# Altium project CGRA_Board_2.PrjPcb (part 1 of 3)
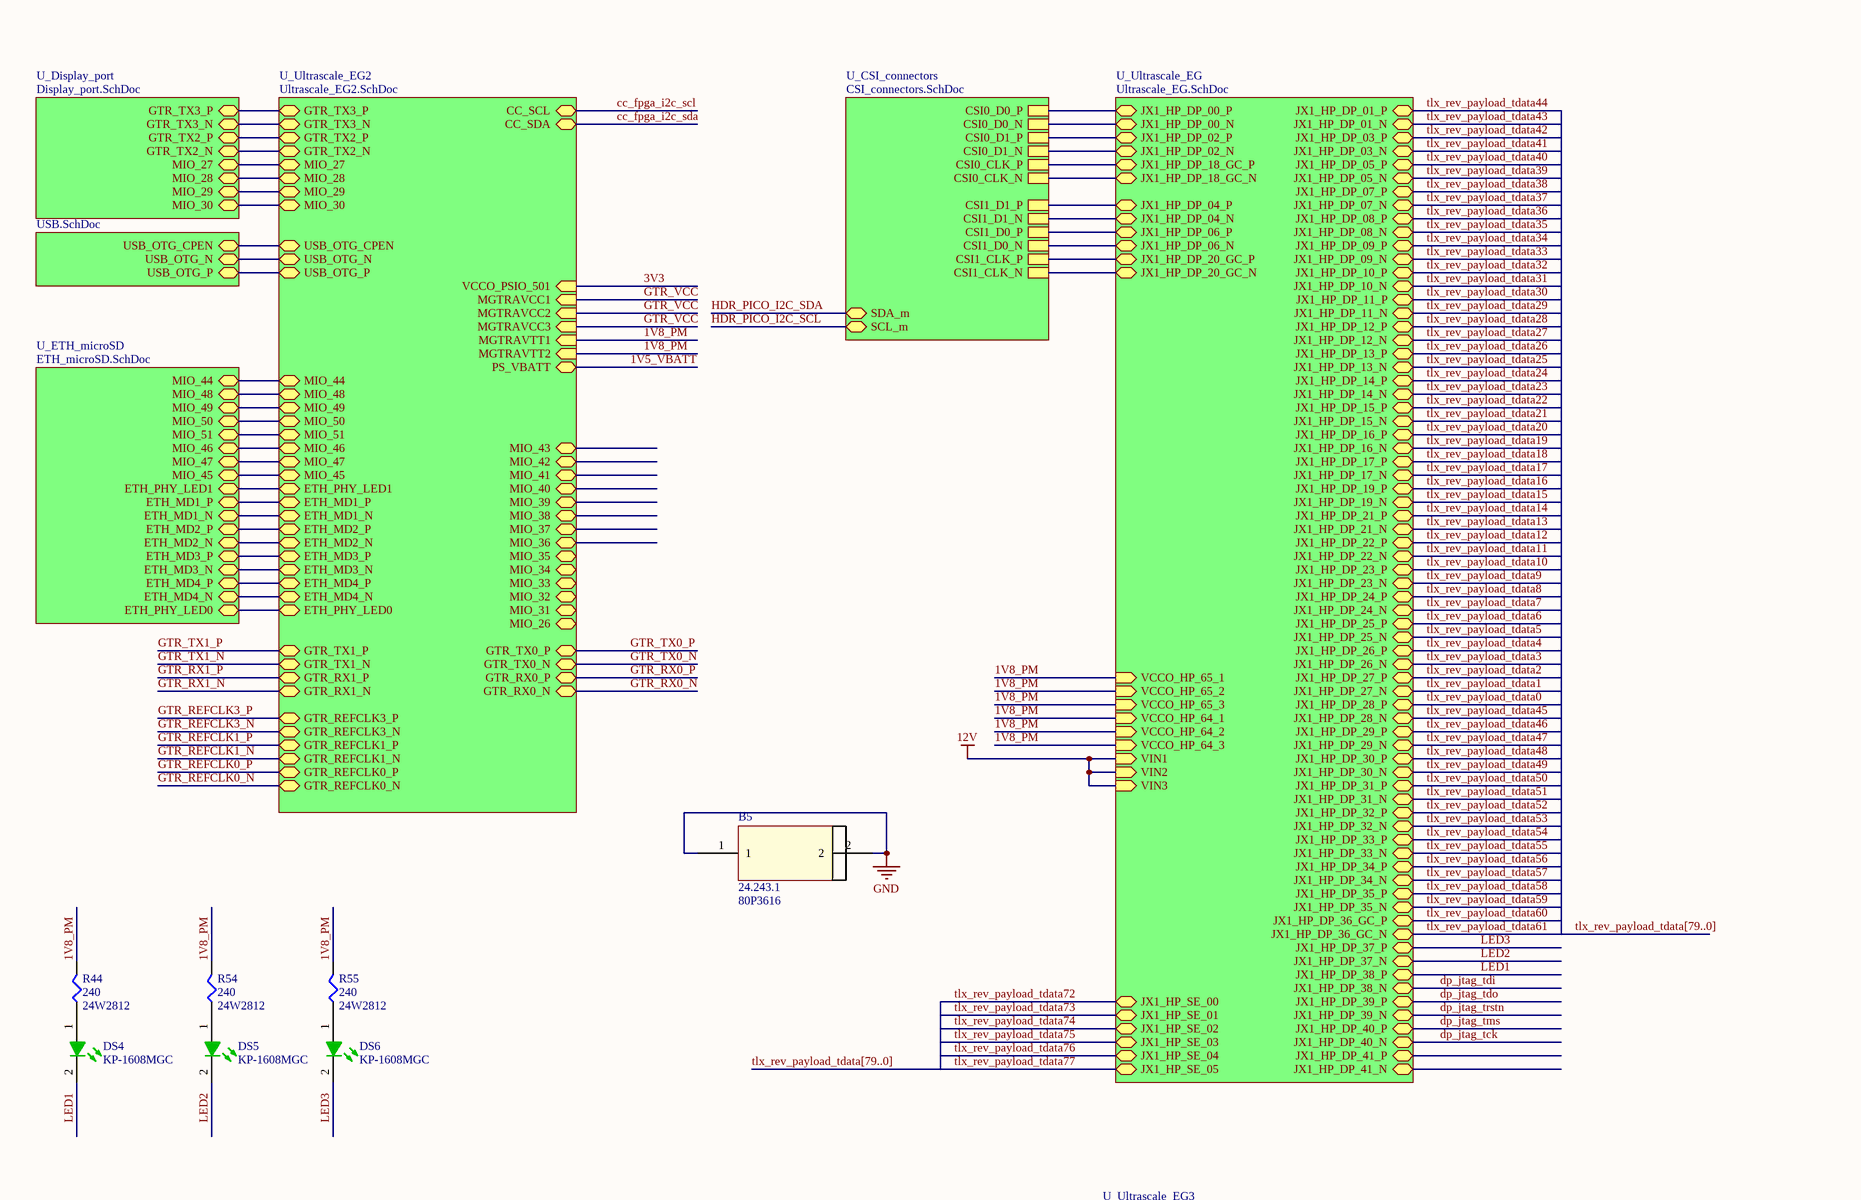
[diagram p0: Top.SchDoc, top left]
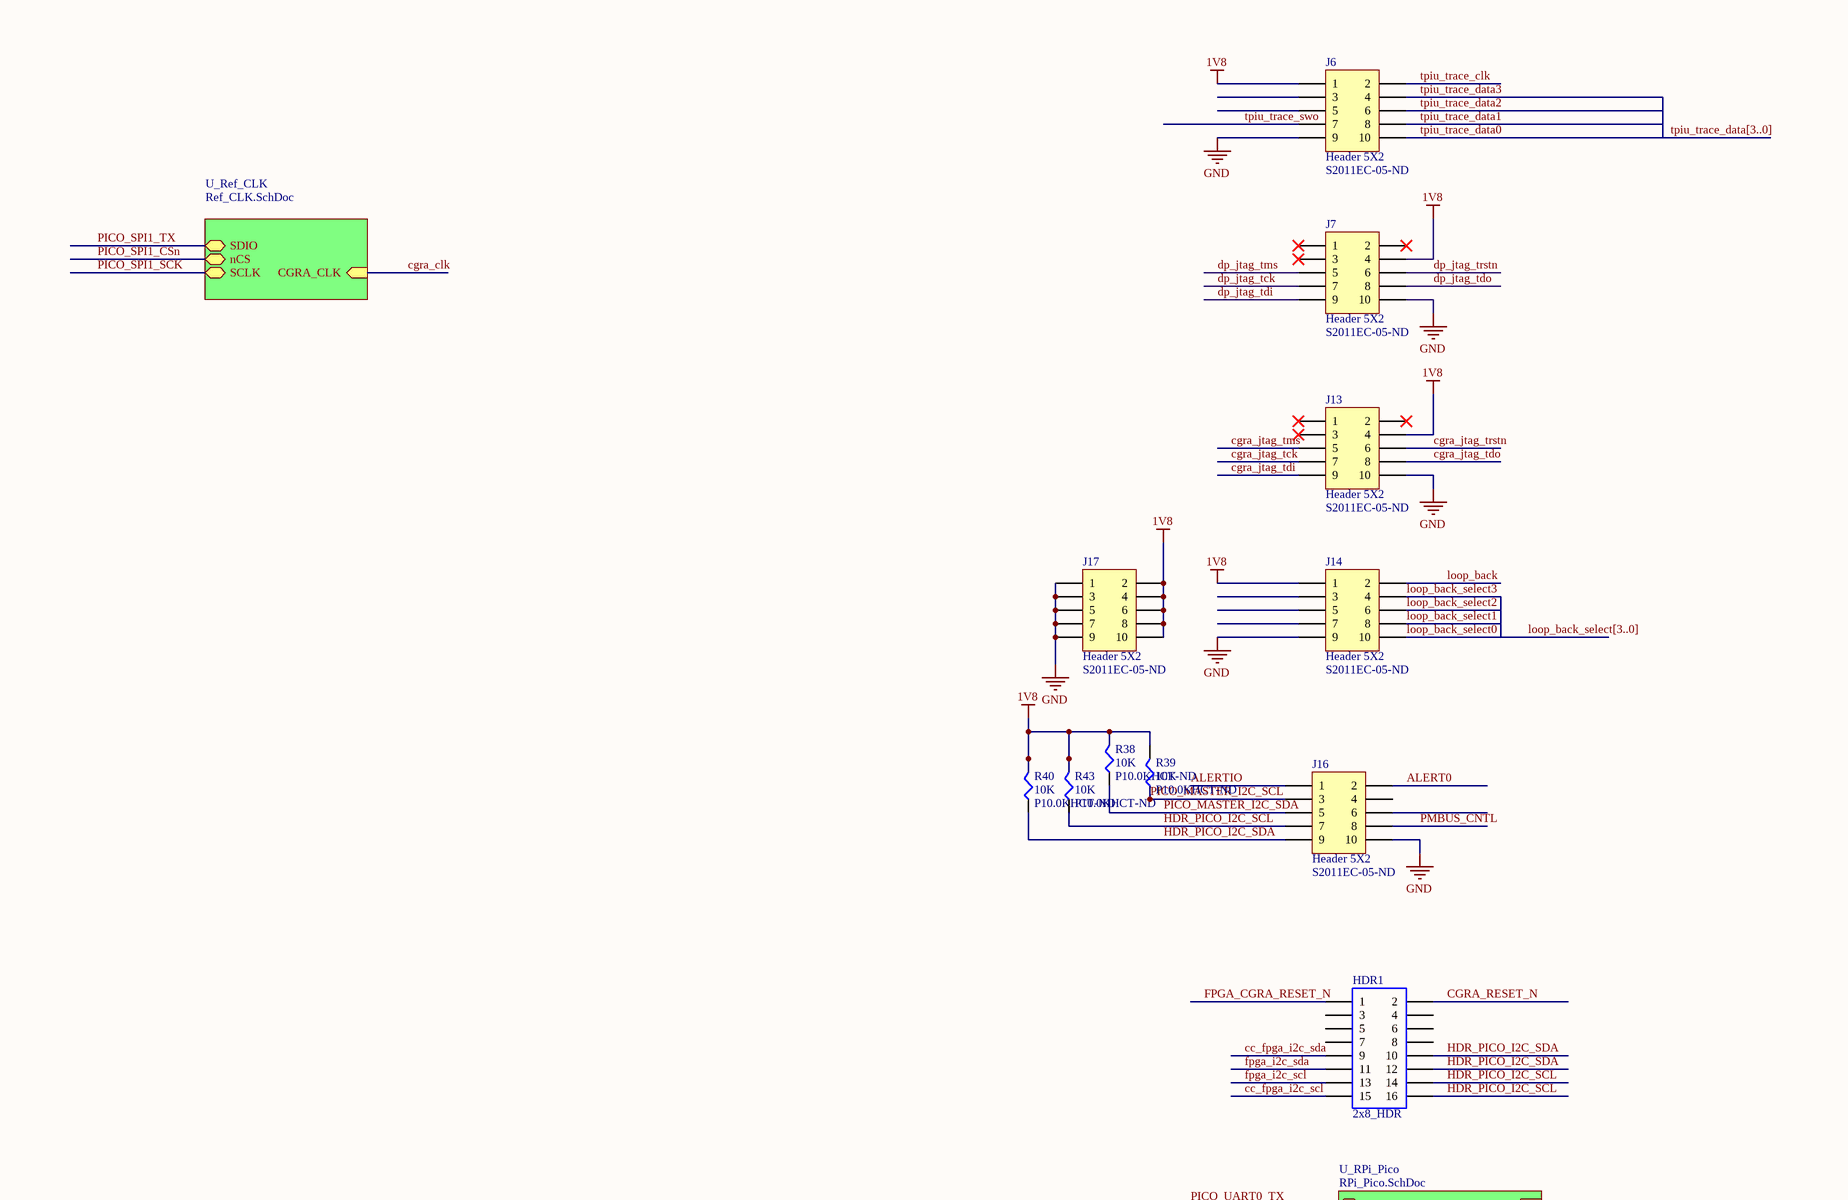
[diagram p1: Top.SchDoc, top right]
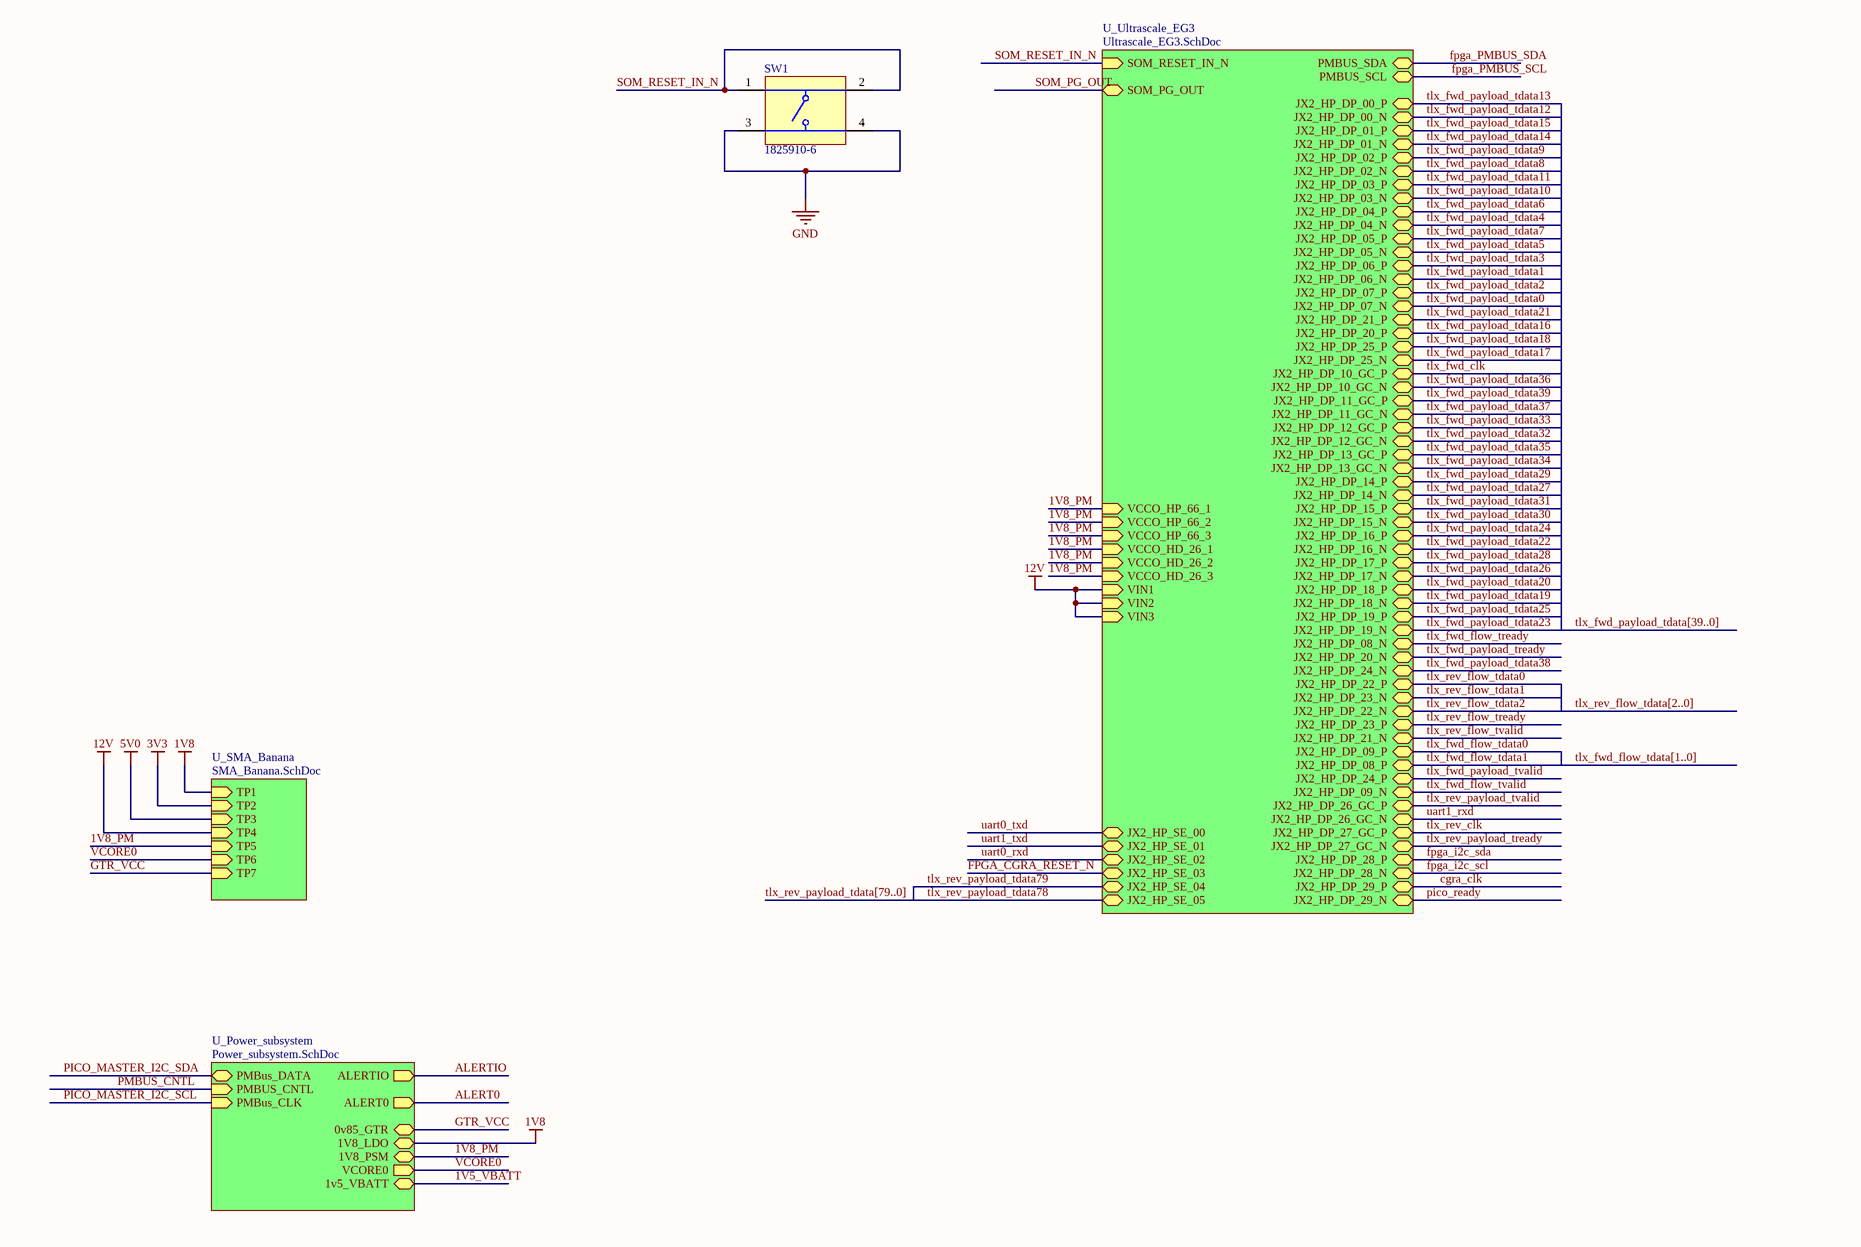
[diagram p2: Top.SchDoc, bottom left]
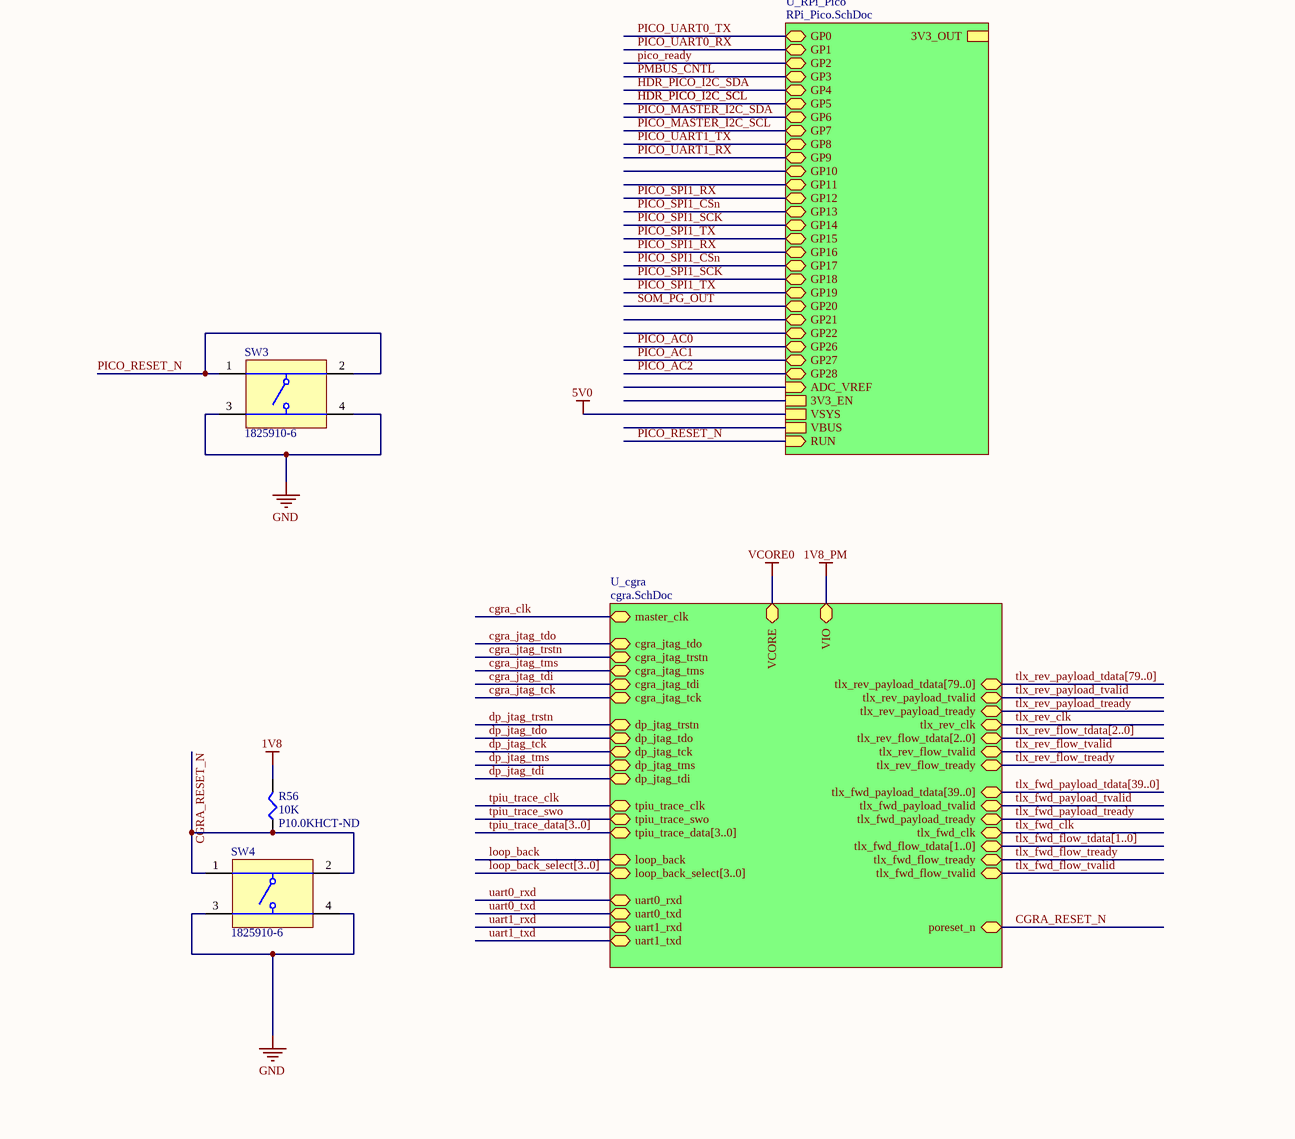
[diagram p3: Top.SchDoc, bottom right]
13 sheets, 205 parts. Net scope: hierarchical (ports join the sheet entries above them; power ports are global).
Board file: CGRA_Board_3.PcbDoc
Sheets:
  Top.SchDoc
    U_Ultrascale_EG2 = Ultrascale_EG2.SchDoc
    U_Ultrascale_EG = Ultrascale_EG.SchDoc
    U_Ultrascale_EG3 = Ultrascale_EG3.SchDoc
    U_USB = USB.SchDoc
    U_ETH_microSD = ETH_microSD.SchDoc
    U_Display_port = Display_port.SchDoc
    U_Power_subsystem = Power_subsystem.SchDoc
      U_TPSM846C23_template = TPSM846C23_template.SchDoc
      U_TPSM846C23_template = TPSM846C23_template.SchDoc
    U_CSI_connectors = CSI_connectors.SchDoc
    U_Ref_CLK = Ref_CLK.SchDoc
    U_SMA_Banana = SMA_Banana.SchDoc
    U_RPi_Pico = RPi_Pico.SchDoc

## Sheet Top.SchDoc
size D; Organization: Altium Limited; Address1: L3, 12a Rodborough Rd; Address2: Frenchs Forest; Address3: NSW; Address4: Australia 2086

### Parts
B5  24.243.1  Supplier Part Number 1: 80P3616  [banana_clip]
DS4  KP-1608MGC  [KING-0603LED_GREEN_V]
DS5  KP-1608MGC  [KING-0603LED_GREEN_V]
DS6  KP-1608MGC  [KING-0603LED_GREEN_V]
HDR1  2x8_HDR  [16POSHDR]
J6  Header 5X2  Supplier Part Number 1: S2011EC-05-ND  [HDR2X5]
J7  Header 5X2  Supplier Part Number 1: S2011EC-05-ND  [HDR2X5]
J13  Header 5X2  Supplier Part Number 1: S2011EC-05-ND  [HDR2X5]
J14  Header 5X2  Supplier Part Number 1: S2011EC-05-ND  [HDR2X5]
J16  Header 5X2  Supplier Part Number 1: S2011EC-05-ND  [HDR2X5]
J17  Header 5X2  Supplier Part Number 1: S2011EC-05-ND  [HDR2X5]
R38  Resistance: 10K  Supplier Part Number 1: P10.0KHCT-ND  [RESC1608X06N]  (hidden comment: RES_10K_0603)
R39  Resistance: 10K  Supplier Part Number 1: P10.0KHCT-ND  [RESC1608X06N]  (hidden comment: RES_10K_0603)
R40  Resistance: 10K  Supplier Part Number 1: P10.0KHCT-ND  [RESC1608X06N]  (hidden comment: RES_10K_0603)
R43  Resistance: 10K  Supplier Part Number 1: P10.0KHCT-ND  [RESC1608X06N]  (hidden comment: RES_10K_0603)
R44  Resistance: 240  Supplier Part Number 1: 24W2812  [RESC1608X06N]  (hidden comment: RES_240_0603)
R54  Resistance: 240  Supplier Part Number 1: 24W2812  [RESC1608X06N]  (hidden comment: RES_240_0603)
R55  Resistance: 240  Supplier Part Number 1: 24W2812  [RESC1608X06N]  (hidden comment: RES_240_0603)
R56  Resistance: 10K  Supplier Part Number 1: P10.0KHCT-ND  [RESC1608X06N]  (hidden comment: RES_10K_0603)
SW1  1825910-6  [TECO-1825910-6_V]
SW3  1825910-6  [TECO-1825910-6_V]
SW4  1825910-6  [TECO-1825910-6_V]

### Sub-sheets
U_cgra = cgra.SchDoc (file not in this document): master_clk (bidir), cgra_jtag_tdo (bidir), cgra_jtag_trstn (bidir), cgra_jtag_tms (bidir), cgra_jtag_tdi (bidir), cgra_jtag_tck (bidir), dp_jtag_trstn (bidir), dp_jtag_tdo (bidir), dp_jtag_tck (bidir), dp_jtag_tms (bidir), dp_jtag_tdi (bidir), tlx_fwd_flow_tvalid (bidir), tlx_fwd_flow_tready (bidir), tlx_rev_flow_tready (bidir), tlx_rev_flow_tvalid (bidir), tlx_rev_clk (bidir), tlx_fwd_clk (bidir), tlx_rev_payload_tready (bidir), tlx_rev_payload_tvalid (bidir), tpiu_trace_clk (bidir), tpiu_trace_swo (bidir), tpiu_trace_data[3..0] (bidir), loop_back_select[3..0] (bidir), tlx_rev_flow_tdata[2..0] (bidir), tlx_fwd_flow_tdata[1..0] (bidir), tlx_fwd_payload_tdata[39..0] (bidir), tlx_rev_payload_tdata[79..0] (bidir), VCORE (bidir), VIO (bidir), loop_back (bidir), poreset_n (bidir), tlx_fwd_payload_tready (bidir), tlx_fwd_payload_tvalid (bidir), uart0_txd (bidir), uart1_txd (bidir), uart1_rxd (bidir), uart0_rxd (bidir)
U_CSI_connectors = CSI_connectors.SchDoc: CSI0_CLK_P, CSI0_CLK_N, CSI0_D0_P, CSI0_D0_N, CSI0_D1_P, CSI0_D1_N, CSI1_CLK_P, CSI1_CLK_N, CSI1_D1_P, CSI1_D1_N, CSI1_D0_P, CSI1_D0_N, SDA_m (bidir), SCL_m (bidir)
U_Display_port = Display_port.SchDoc: GTR_TX3_P (bidir), GTR_TX3_N (bidir), GTR_TX2_P (bidir), GTR_TX2_N (bidir), MIO_28 (bidir), MIO_29 (bidir), MIO_27 (bidir), MIO_30 (bidir)
U_ETH_microSD = ETH_microSD.SchDoc: MIO_44 (bidir), MIO_48 (bidir), MIO_49 (bidir), MIO_50 (bidir), MIO_51 (bidir), MIO_46 (bidir), MIO_47 (bidir), MIO_45 (bidir), ETH_PHY_LED1 (bidir), ETH_MD1_P (bidir), ETH_MD1_N (bidir), ETH_MD2_P (bidir), ETH_MD2_N (bidir), ETH_MD3_P (bidir), ETH_MD3_N (bidir), ETH_MD4_P (bidir), ETH_MD4_N (bidir), ETH_PHY_LED0 (bidir)
U_Power_subsystem = Power_subsystem.SchDoc: ALERTIO (out), ALERT0 (out), PMBus_DATA (bidir), PMBUS_CNTL (in), PMBus_CLK (in), 1V8_LDO (bidir), 1V8_PSM (bidir), VCORE0 (out), 0v85_GTR (bidir), 1v5_VBATT (bidir)
U_Ref_CLK = Ref_CLK.SchDoc: CGRA_CLK (in), SDIO (bidir), nCS (bidir), SCLK (bidir)
U_RPi_Pico = RPi_Pico.SchDoc: GP0 (bidir), GP1 (bidir), GP2 (bidir), GP3 (bidir), GP4 (bidir), GP5 (bidir), GP6 (bidir), GP7 (bidir), GP8 (bidir), GP9 (bidir), GP10 (bidir), GP11 (bidir), GP12 (bidir), GP13 (bidir), GP14 (bidir), GP15 (bidir), GP16 (bidir), GP17 (bidir), GP19 (bidir), GP20 (bidir), GP21 (bidir), GP22 (bidir), GP26 (bidir), GP27 (bidir), GP28 (bidir), ADC_VREF (in), RUN (in), GP18 (bidir), 3V3_EN, 3V3_OUT, VSYS, VBUS
U_SMA_Banana = SMA_Banana.SchDoc: TP1 (in), TP2 (in), TP3 (in), TP4 (in), TP5 (in), TP6 (in), TP7 (in)
U_Ultrascale_EG = Ultrascale_EG.SchDoc: JX1_HP_DP_00_P (bidir), JX1_HP_DP_00_N (bidir), JX1_HP_DP_02_P (bidir), JX1_HP_DP_02_N (bidir), JX1_HP_DP_04_P (bidir), JX1_HP_DP_04_N (bidir), JX1_HP_DP_06_P (bidir), JX1_HP_DP_06_N (bidir), JX1_HP_DP_08_P (bidir), JX1_HP_DP_08_N (bidir), JX1_HP_DP_10_P (bidir), JX1_HP_DP_10_N (bidir), JX1_HP_DP_12_P (bidir), JX1_HP_DP_12_N (bidir), JX1_HP_DP_14_P (bidir), JX1_HP_DP_14_N (bidir), JX1_HP_DP_16_P (bidir), JX1_HP_DP_16_N (bidir), JX1_HP_DP_18_GC_P (bidir), JX1_HP_DP_18_GC_N (bidir), JX1_HP_DP_20_GC_N (bidir), JX1_HP_DP_20_GC_P (bidir), JX1_HP_DP_22_P (bidir), JX1_HP_DP_22_N (bidir), JX1_HP_DP_24_P (bidir), JX1_HP_DP_24_N (bidir), JX1_HP_DP_26_P (bidir), JX1_HP_DP_26_N (bidir), JX1_HP_DP_28_P (bidir), JX1_HP_DP_28_N (bidir), JX1_HP_DP_30_P (bidir), JX1_HP_DP_30_N (bidir), JX1_HP_DP_32_P (bidir), JX1_HP_DP_32_N (bidir), JX1_HP_DP_34_P (bidir), JX1_HP_DP_34_N (bidir), JX1_HP_DP_36_GC_P (bidir), JX1_HP_DP_36_GC_N (bidir), JX1_HP_DP_01_P (bidir), JX1_HP_DP_01_N (bidir), JX1_HP_DP_03_P (bidir), JX1_HP_DP_03_N (bidir), JX1_HP_DP_05_P (bidir), JX1_HP_DP_05_N (bidir), JX1_HP_DP_07_P (bidir), JX1_HP_DP_07_N (bidir), JX1_HP_DP_09_P (bidir), JX1_HP_DP_09_N (bidir), JX1_HP_DP_11_P (bidir), JX1_HP_DP_11_N (bidir), JX1_HP_DP_13_P (bidir), JX1_HP_DP_13_N (bidir), JX1_HP_DP_15_P (bidir), JX1_HP_DP_15_N (bidir), JX1_HP_DP_17_P (bidir), JX1_HP_DP_17_N (bidir), JX1_HP_DP_19_P (bidir), JX1_HP_DP_19_N (bidir), JX1_HP_DP_21_P (bidir), JX1_HP_DP_21_N (bidir), JX1_HP_DP_23_P (bidir), JX1_HP_DP_23_N (bidir), JX1_HP_DP_25_P (bidir), JX1_HP_DP_25_N (bidir), JX1_HP_DP_27_P (bidir), JX1_HP_DP_27_N (bidir), JX1_HP_DP_39_P (bidir), JX1_HP_DP_39_N (bidir), JX1_HP_DP_41_P (bidir), JX1_HP_DP_41_N (bidir), VIN3 (in), JX1_HP_SE_01 (bidir), JX1_HP_SE_03 (bidir), JX1_HP_SE_05 (bidir), JX1_HP_SE_00 (bidir), VIN1 (in), VIN2 (in), JX1_HP_DP_40_N (bidir), JX1_HP_DP_40_P (bidir), JX1_HP_DP_38_N (bidir), JX1_HP_DP_38_P (bidir), JX1_HP_DP_37_N (bidir), JX1_HP_DP_35_N (bidir), JX1_HP_DP_37_P (bidir), JX1_HP_DP_35_P (bidir), JX1_HP_DP_33_N (bidir), JX1_HP_DP_31_N (bidir), JX1_HP_DP_31_P (bidir), VCCO_HP_65_3 (in), VCCO_HP_64_2 (in), VCCO_HP_65_2 (in), VCCO_HP_64_1 (in), VCCO_HP_65_1 (in), VCCO_HP_64_3 (in), JX1_HP_DP_33_P (bidir), JX1_HP_DP_29_P (bidir), JX1_HP_SE_04 (bidir), JX1_HP_SE_02 (bidir), JX1_HP_DP_29_N (bidir)
U_Ultrascale_EG2 = Ultrascale_EG2.SchDoc: GTR_TX3_P (bidir), GTR_TX3_N (bidir), GTR_TX2_P (bidir), GTR_TX2_N (bidir), GTR_TX1_P (bidir), GTR_TX1_N (bidir), GTR_TX0_P (bidir), GTR_TX0_N (bidir), GTR_REFCLK3_P (bidir), GTR_REFCLK3_N (bidir), GTR_REFCLK1_P (bidir), GTR_REFCLK1_N (bidir), CC_SDA (bidir), USB_OTG_P (bidir), USB_OTG_N (bidir), ETH_PHY_LED0 (bidir), ETH_MD1_P (bidir), ETH_MD1_N (bidir), ETH_MD3_P (bidir), ETH_MD3_N (bidir), MIO_28 (bidir), MIO_44 (bidir), MIO_46 (bidir), MIO_48 (bidir), MIO_50 (bidir), GTR_RX1_P (bidir), GTR_RX1_N (bidir), GTR_RX0_P (bidir), GTR_RX0_N (bidir), CC_SCL (bidir), USB_OTG_CPEN (bidir), ETH_PHY_LED1 (bidir), ETH_MD2_P (bidir), ETH_MD2_N (bidir), ETH_MD4_P (bidir), ETH_MD4_N (bidir), MIO_27 (bidir), MIO_29 (bidir), MIO_45 (bidir), MIO_47 (bidir), MIO_49 (bidir), MIO_51 (bidir), MIO_30 (bidir), MGTRAVCC1 (in), MGTRAVCC3 (in), VCCO_PSIO_501 (in), MGTRAVTT1 (in), MGTRAVTT2 (in), MGTRAVCC2 (in), GTR_REFCLK0_P (bidir), GTR_REFCLK0_N (bidir), MIO_37 (bidir), PS_VBATT (bidir), MIO_41 (bidir), MIO_35 (bidir), MIO_36 (bidir), MIO_43 (bidir), MIO_40 (bidir), MIO_39 (bidir), MIO_33 (bidir), MIO_31 (bidir), MIO_38 (bidir), MIO_32 (bidir), MIO_34 (bidir), MIO_42 (bidir), MIO_26 (bidir)
U_Ultrascale_EG3 = Ultrascale_EG3.SchDoc: PMBUS_SDA (bidir), JX2_HP_DP_00_P (bidir), JX2_HP_DP_00_N (bidir), JX2_HP_DP_02_P (bidir), JX2_HP_DP_02_N (bidir), JX2_HP_DP_04_P (bidir), JX2_HP_DP_04_N (bidir), JX2_HP_DP_06_P (bidir), JX2_HP_DP_06_N (bidir), JX2_HP_DP_08_P (bidir), JX2_HP_DP_08_N (bidir), JX2_HP_DP_10_GC_P (bidir), JX2_HP_DP_10_GC_N (bidir), JX2_HP_DP_12_GC_P (bidir), JX2_HP_DP_12_GC_N (bidir), JX2_HP_DP_14_P (bidir), JX2_HP_DP_14_N (bidir), JX2_HP_DP_16_P (bidir), JX2_HP_DP_16_N (bidir), JX2_HP_DP_18_P (bidir), JX2_HP_DP_18_N (bidir), JX2_HP_DP_20_P (bidir), JX2_HP_DP_20_N (bidir), JX2_HP_DP_22_P (bidir), JX2_HP_DP_22_N (bidir), JX2_HP_DP_24_P (bidir), JX2_HP_DP_24_N (bidir), JX2_HP_DP_26_GC_P (bidir), JX2_HP_DP_26_GC_N (bidir), JX2_HP_DP_28_P (bidir), JX2_HP_DP_28_N (bidir), JX2_HP_SE_04 (bidir), PMBUS_SCL (bidir), JX2_HP_DP_01_P (bidir), JX2_HP_DP_01_N (bidir), JX2_HP_DP_03_P (bidir), JX2_HP_DP_03_N (bidir), JX2_HP_DP_05_P (bidir), JX2_HP_DP_05_N (bidir), JX2_HP_DP_07_P (bidir), JX2_HP_DP_07_N (bidir), JX2_HP_DP_09_P (bidir), JX2_HP_DP_09_N (bidir), JX2_HP_DP_11_GC_P (bidir), JX2_HP_DP_11_GC_N (bidir), JX2_HP_DP_13_GC_P (bidir), JX2_HP_DP_13_GC_N (bidir), JX2_HP_DP_15_P (bidir), JX2_HP_DP_15_N (bidir), JX2_HP_DP_17_P (bidir), JX2_HP_DP_17_N (bidir), JX2_HP_DP_19_P (bidir), JX2_HP_DP_19_N (bidir), JX2_HP_DP_21_P (bidir), JX2_HP_DP_21_N (bidir), JX2_HP_DP_23_P (bidir), JX2_HP_DP_23_N (bidir), JX2_HP_DP_25_P (bidir), JX2_HP_DP_25_N (bidir), JX2_HP_DP_27_GC_P (bidir), JX2_HP_DP_27_GC_N (bidir), JX2_HP_DP_29_P (bidir), JX2_HP_DP_29_N (bidir), JX2_HP_SE_02 (bidir), JX2_HP_SE_00 (bidir), JX2_HP_SE_05 (bidir), JX2_HP_SE_03 (bidir), VIN2 (in), VIN1 (in), JX2_HP_SE_01 (bidir), VIN3 (in), VCCO_HD_26_3 (in), VCCO_HD_26_2 (in), VCCO_HD_26_1 (in), VCCO_HP_66_3 (in), VCCO_HP_66_2 (in), VCCO_HP_66_1 (in), SOM_RESET_IN_N (in), SOM_PG_OUT (bidir)
U_USB = USB.SchDoc: USB_OTG_CPEN (bidir), USB_OTG_N (bidir), USB_OTG_P (bidir)

### Nets
1V8: J6.1 J7.4 J13.4 J14.1 J17.2 J17.4 J17.6 J17.8 J17.10 R38.1 R39.1 R40.1 R43.1 R56.1 ; sheet U_Power_subsystem/1V8_LDO, sheet U_SMA_Banana/TP1  [project net 1V8_OUT]
1V8_PM: R44.1 R54.1 R55.1 ; sheet U_Ultrascale_EG2/MGTRAVTT1, sheet U_Ultrascale_EG2/MGTRAVTT2, sheet U_Ultrascale_EG/VCCO_HP_65_3, sheet U_Ultrascale_EG/VCCO_HP_64_2, sheet U_Ultrascale_EG/VCCO_HP_65_2, sheet U_Ultrascale_EG/VCCO_HP_64_1, sheet U_Ultrascale_EG/VCCO_HP_65_1, sheet U_Ultrascale_EG/VCCO_HP_64_3, sheet U_Ultrascale_EG3/VCCO_HD_26_3, sheet U_Ultrascale_EG3/VCCO_HD_26_2, sheet U_Ultrascale_EG3/VCCO_HD_26_1, sheet U_Ultrascale_EG3/VCCO_HP_66_3, sheet U_Ultrascale_EG3/VCCO_HP_66_2, sheet U_Ultrascale_EG3/VCCO_HP_66_1, sheet U_Power_subsystem/1V8_PSM, sheet U_SMA_Banana/TP5, sheet U_cgra/VIO
3V3: sheet U_Ultrascale_EG2/VCCO_PSIO_501, sheet U_SMA_Banana/TP2
5V0: sheet U_SMA_Banana/TP3, sheet U_RPi_Pico/VSYS
12V: sheet U_Ultrascale_EG/VIN3, sheet U_Ultrascale_EG/VIN1, sheet U_Ultrascale_EG/VIN2, sheet U_Ultrascale_EG3/VIN2, sheet U_Ultrascale_EG3/VIN1, sheet U_Ultrascale_EG3/VIN3, sheet U_SMA_Banana/TP4
GND: B5.1 B5.2 J6.9 J7.10 J13.10 J14.9 J16.10 J17.1 J17.3 J17.5 J17.7 J17.9 SW1.3 SW1.4 SW3.3 SW3.4 SW4.3 SW4.4
VCORE0: sheet U_Power_subsystem/VCORE0, sheet U_SMA_Banana/TP6, sheet U_cgra/VCORE  [project net 0V8_OUT]
1V5_VBATT: sheet U_Ultrascale_EG2/PS_VBATT, sheet U_Power_subsystem/1v5_VBATT
ALERT0: J16.2 ; sheet U_Power_subsystem/ALERT0
ALERTIO: J16.1 ; sheet U_Power_subsystem/ALERTIO
CAM0_C_N: sheet U_Ultrascale_EG/JX1_HP_DP_18_GC_N, sheet U_CSI_connectors/CSI0_CLK_N
CAM0_C_P: sheet U_Ultrascale_EG/JX1_HP_DP_18_GC_P, sheet U_CSI_connectors/CSI0_CLK_P
CAM0_D0_N: sheet U_Ultrascale_EG/JX1_HP_DP_00_N, sheet U_CSI_connectors/CSI0_D0_N
CAM0_D0_P: sheet U_Ultrascale_EG/JX1_HP_DP_00_P, sheet U_CSI_connectors/CSI0_D0_P
CAM0_D1_N: sheet U_Ultrascale_EG/JX1_HP_DP_02_N, sheet U_CSI_connectors/CSI0_D1_N
CAM0_D1_P: sheet U_Ultrascale_EG/JX1_HP_DP_02_P, sheet U_CSI_connectors/CSI0_D1_P
CAM1_C_N: sheet U_Ultrascale_EG/JX1_HP_DP_20_GC_N, sheet U_CSI_connectors/CSI1_CLK_N
CAM1_C_P: sheet U_Ultrascale_EG/JX1_HP_DP_20_GC_P, sheet U_CSI_connectors/CSI1_CLK_P
CAM1_D0_N: sheet U_Ultrascale_EG/JX1_HP_DP_06_N, sheet U_CSI_connectors/CSI1_D0_N
CAM1_D0_P: sheet U_Ultrascale_EG/JX1_HP_DP_06_P, sheet U_CSI_connectors/CSI1_D0_P
CAM1_D1_N: sheet U_Ultrascale_EG/JX1_HP_DP_04_N, sheet U_CSI_connectors/CSI1_D1_N
CAM1_D1_P: sheet U_Ultrascale_EG/JX1_HP_DP_04_P, sheet U_CSI_connectors/CSI1_D1_P
cc_fpga_i2c_scl: HDR1.15 ; sheet U_Ultrascale_EG2/CC_SCL
cc_fpga_i2c_sda: HDR1.9 ; sheet U_Ultrascale_EG2/CC_SDA
cgra_clk: sheet U_Ultrascale_EG3/JX2_HP_DP_29_P, sheet U_Ref_CLK/CGRA_CLK, sheet U_cgra/master_clk
cgra_jtag_tck: J13.7 ; sheet U_cgra/cgra_jtag_tck
cgra_jtag_tdi: J13.9 ; sheet U_cgra/cgra_jtag_tdi
cgra_jtag_tdo: J13.8 ; sheet U_cgra/cgra_jtag_tdo
cgra_jtag_tms: J13.5 ; sheet U_cgra/cgra_jtag_tms
cgra_jtag_trstn: J13.6 ; sheet U_cgra/cgra_jtag_trstn
CGRA_RESET_N: HDR1.2 R56.2 SW4.1 SW4.2 ; sheet U_cgra/poreset_n
dp_jtag_tck: J7.7 ; sheet U_Ultrascale_EG/JX1_HP_DP_40_N, sheet U_cgra/dp_jtag_tck
dp_jtag_tdi: J7.9 ; sheet U_Ultrascale_EG/JX1_HP_DP_38_N, sheet U_cgra/dp_jtag_tdi
dp_jtag_tdo: J7.8 ; sheet U_Ultrascale_EG/JX1_HP_DP_39_P, sheet U_cgra/dp_jtag_tdo
dp_jtag_tms: J7.5 ; sheet U_Ultrascale_EG/JX1_HP_DP_40_P, sheet U_cgra/dp_jtag_tms
dp_jtag_trstn: J7.6 ; sheet U_Ultrascale_EG/JX1_HP_DP_39_N, sheet U_cgra/dp_jtag_trstn
ETH_MD1_N: sheet U_Ultrascale_EG2/ETH_MD1_N, sheet U_ETH_microSD/ETH_MD1_N
ETH_MD1_P: sheet U_Ultrascale_EG2/ETH_MD1_P, sheet U_ETH_microSD/ETH_MD1_P
ETH_MD2_N: sheet U_Ultrascale_EG2/ETH_MD2_N, sheet U_ETH_microSD/ETH_MD2_N
ETH_MD2_P: sheet U_Ultrascale_EG2/ETH_MD2_P, sheet U_ETH_microSD/ETH_MD2_P
ETH_MD3_N: sheet U_Ultrascale_EG2/ETH_MD3_N, sheet U_ETH_microSD/ETH_MD3_N
ETH_MD3_P: sheet U_Ultrascale_EG2/ETH_MD3_P, sheet U_ETH_microSD/ETH_MD3_P
ETH_MD4_N: sheet U_Ultrascale_EG2/ETH_MD4_N, sheet U_ETH_microSD/ETH_MD4_N
ETH_MD4_P: sheet U_Ultrascale_EG2/ETH_MD4_P, sheet U_ETH_microSD/ETH_MD4_P
FPGA_CGRA_RESET_N: HDR1.1 ; sheet U_Ultrascale_EG3/JX2_HP_SE_03
fpga_i2c_scl: HDR1.13 ; sheet U_Ultrascale_EG3/JX2_HP_DP_28_N
fpga_i2c_sda: HDR1.11 ; sheet U_Ultrascale_EG3/JX2_HP_DP_28_P
GTR_TX2_N: sheet U_Ultrascale_EG2/GTR_TX2_N, sheet U_Display_port/GTR_TX2_N
GTR_TX2_P: sheet U_Ultrascale_EG2/GTR_TX2_P, sheet U_Display_port/GTR_TX2_P
GTR_TX3_N: sheet U_Ultrascale_EG2/GTR_TX3_N, sheet U_Display_port/GTR_TX3_N
GTR_TX3_P: sheet U_Ultrascale_EG2/GTR_TX3_P, sheet U_Display_port/GTR_TX3_P
GTR_VCC: sheet U_Ultrascale_EG2/MGTRAVCC1, sheet U_Ultrascale_EG2/MGTRAVCC3, sheet U_Ultrascale_EG2/MGTRAVCC2, sheet U_Power_subsystem/0v85_GTR, sheet U_SMA_Banana/TP7
HDR_PICO_I2C_SCL: HDR1.14 HDR1.16 J16.7 R43.2 ; sheet U_CSI_connectors/SCL_m, sheet U_RPi_Pico/GP5
HDR_PICO_I2C_SDA: HDR1.10 HDR1.12 J16.9 R40.2 ; sheet U_CSI_connectors/SDA_m, sheet U_RPi_Pico/GP4
LED1: DS4.2(K) ; sheet U_Ultrascale_EG/JX1_HP_DP_38_P
LED2: DS5.2(K) ; sheet U_Ultrascale_EG/JX1_HP_DP_37_N
LED3: DS6.2(K) ; sheet U_Ultrascale_EG/JX1_HP_DP_37_P
loop_back: J14.2 ; sheet U_cgra/loop_back
loop_back_select0: J14.10
loop_back_select1: J14.8
loop_back_select2: J14.6
loop_back_select3: J14.4
PICO_MASTER_I2C_SCL: J16.3 R39.2 ; sheet U_Power_subsystem/PMBus_CLK, sheet U_RPi_Pico/GP7
PICO_MASTER_I2C_SDA: J16.5 R38.2 ; sheet U_Power_subsystem/PMBus_DATA, sheet U_RPi_Pico/GP6
pico_ready: sheet U_Ultrascale_EG3/JX2_HP_DP_29_N, sheet U_RPi_Pico/GP2
PICO_RESET_N: SW3.1 SW3.2 ; sheet U_RPi_Pico/RUN
PICO_SPI1_CSn: sheet U_Ref_CLK/nCS, sheet U_RPi_Pico/GP13, sheet U_RPi_Pico/GP17  [project net nCS]
PICO_SPI1_RX: sheet U_RPi_Pico/GP12, sheet U_RPi_Pico/GP16
PICO_SPI1_SCK: sheet U_Ref_CLK/SCLK, sheet U_RPi_Pico/GP14, sheet U_RPi_Pico/GP18
PICO_SPI1_TX: sheet U_Ref_CLK/SDIO, sheet U_RPi_Pico/GP15, sheet U_RPi_Pico/GP19
PMBUS_CNTL: J16.8 ; sheet U_Power_subsystem/PMBUS_CNTL, sheet U_RPi_Pico/GP3
SOM_PG_OUT: sheet U_Ultrascale_EG3/SOM_PG_OUT, sheet U_RPi_Pico/GP20
SOM_RESET_IN_N: SW1.1 SW1.2 ; sheet U_Ultrascale_EG3/SOM_RESET_IN_N
tlx_fwd_clk: sheet U_Ultrascale_EG3/JX2_HP_DP_10_GC_P, sheet U_cgra/tlx_fwd_clk
tlx_fwd_flow_tready: sheet U_Ultrascale_EG3/JX2_HP_DP_08_N, sheet U_cgra/tlx_fwd_flow_tready
tlx_fwd_flow_tvalid: sheet U_Ultrascale_EG3/JX2_HP_DP_09_N, sheet U_cgra/tlx_fwd_flow_tvalid
tlx_fwd_payload_tready: sheet U_Ultrascale_EG3/JX2_HP_DP_20_N, sheet U_cgra/tlx_fwd_payload_tready
tlx_fwd_payload_tvalid: sheet U_Ultrascale_EG3/JX2_HP_DP_24_P, sheet U_cgra/tlx_fwd_payload_tvalid
tlx_rev_clk: sheet U_Ultrascale_EG3/JX2_HP_DP_27_GC_P, sheet U_cgra/tlx_rev_clk
tlx_rev_flow_tready: sheet U_Ultrascale_EG3/JX2_HP_DP_23_P, sheet U_cgra/tlx_rev_flow_tready
tlx_rev_flow_tvalid: sheet U_Ultrascale_EG3/JX2_HP_DP_21_N, sheet U_cgra/tlx_rev_flow_tvalid
tlx_rev_payload_tready: sheet U_Ultrascale_EG3/JX2_HP_DP_27_GC_N, sheet U_cgra/tlx_rev_payload_tready
tlx_rev_payload_tvalid: sheet U_Ultrascale_EG3/JX2_HP_DP_26_GC_P, sheet U_cgra/tlx_rev_payload_tvalid
tpiu_trace_clk: J6.2 ; sheet U_cgra/tpiu_trace_clk
tpiu_trace_data0: J6.10
tpiu_trace_data1: J6.8
tpiu_trace_data2: J6.6
tpiu_trace_data3: J6.4
tpiu_trace_swo: J6.7 ; sheet U_cgra/tpiu_trace_swo
uart0_rxd: sheet U_Ultrascale_EG3/JX2_HP_SE_02, sheet U_cgra/uart0_rxd
uart0_txd: sheet U_Ultrascale_EG3/JX2_HP_SE_00, sheet U_cgra/uart0_txd
uart1_rxd: sheet U_Ultrascale_EG3/JX2_HP_DP_26_GC_N, sheet U_cgra/uart1_rxd
uart1_txd: sheet U_Ultrascale_EG3/JX2_HP_SE_01, sheet U_cgra/uart1_txd
USB3_D_N: sheet U_Ultrascale_EG2/USB_OTG_N, sheet U_USB/USB_OTG_N
USB3_D_P: sheet U_Ultrascale_EG2/USB_OTG_P, sheet U_USB/USB_OTG_P
NetDS4_1: DS4.1(A) R44.2
NetDS5_1: DS5.1(A) R54.2
NetDS6_1: DS6.1(A) R55.2
NetJ1_1: sheet U_Ultrascale_EG2/MIO_48, sheet U_ETH_microSD/MIO_48
NetJ1_2: sheet U_Ultrascale_EG2/MIO_49, sheet U_ETH_microSD/MIO_49
NetJ1_3: sheet U_Ultrascale_EG2/MIO_50, sheet U_ETH_microSD/MIO_50
NetJ1_7: sheet U_Ultrascale_EG2/MIO_46, sheet U_ETH_microSD/MIO_46
NetJ1_8: sheet U_Ultrascale_EG2/MIO_47, sheet U_ETH_microSD/MIO_47
NetJ1_10: sheet U_Ultrascale_EG2/MIO_45, sheet U_ETH_microSD/MIO_45
NetJ8_48: sheet U_Ultrascale_EG2/USB_OTG_CPEN, sheet U_USB/USB_OTG_CPEN
NetJ8_52: sheet U_Ultrascale_EG2/ETH_PHY_LED1, sheet U_ETH_microSD/ETH_PHY_LED1
NetJ8_53: sheet U_Ultrascale_EG2/ETH_PHY_LED0, sheet U_ETH_microSD/ETH_PHY_LED0
NetJ8_70: sheet U_Ultrascale_EG2/MIO_27, sheet U_Display_port/MIO_27
NetJ8_71: sheet U_Ultrascale_EG2/MIO_28, sheet U_Display_port/MIO_28
NetJ8_72: sheet U_Ultrascale_EG2/MIO_29, sheet U_Display_port/MIO_29
NetJ8_73: sheet U_Ultrascale_EG2/MIO_30, sheet U_Display_port/MIO_30
NetJ8_93: sheet U_Ultrascale_EG2/MIO_44, sheet U_ETH_microSD/MIO_44
NetJ8_100: sheet U_Ultrascale_EG2/MIO_51, sheet U_ETH_microSD/MIO_51

Not connected (* = marked no-connect by the designer): HDR1 3 4 5 6 7 8; J6 3 5; J7 1* 2* 3*; J13 1* 2* 3*; J14 3 5 7; J16 4 6

### Buses and harness runs
bus loop_back_select[3..0]
bus loop_back_select[3..0] = sheet U_cgra/loop_back_select[3..0]
bus tlx_fwd_flow_tdata[1..0]
bus tlx_fwd_flow_tdata[1..0] = sheet U_cgra/tlx_fwd_flow_tdata[1..0]
bus tlx_fwd_payload_tdata[39..0]
bus tlx_fwd_payload_tdata[39..0] = sheet U_cgra/tlx_fwd_payload_tdata[39..0]
bus tlx_rev_flow_tdata[2..0]
bus tlx_rev_flow_tdata[2..0] = sheet U_cgra/tlx_rev_flow_tdata[2..0]
bus tlx_rev_payload_tdata[79..0]
bus tlx_rev_payload_tdata[79..0] = sheet U_cgra/tlx_rev_payload_tdata[79..0]
bus tpiu_trace_data[3..0]
bus tpiu_trace_data[3..0] = sheet U_cgra/tpiu_trace_data[3..0]

### Notes on the sheet
- Title
- Size:
- Date:
- File:
- D
- Number:
- Time:
- Revision:
- Sheet
- of

### Library data of the parts
DS4-DS6 = CMP-0404-00001-1: LED, SMT, 0603(1608), 1.1mm thickness, Green; Manufacturer: Kingbright; Reverse Voltage: 5 V; Power Dissipation: 75 mW; Forward Current: 30 mA; Packing Type: 2000 pcs / reel; Mounting Technology: Surface Mount; Storage Temperature: -40 to +85 degC; ComponentLink1URL: http://www.kingbright.com/; PackageDescription: 2-Pin SMT LED, 1.6 x 0.8 mm Pitch; PartNumber: KP-1608MGC; PackageReference: 0603LED_GREEN; ComponentLink1Description: Manufacturer URL
J6 J7 J13 J14 J16 J17 = Header 5X2: Header, 5-Pin, Dual row; LatestRevisionDate: 17-Jul-2002; LatestRevisionNote: Re-released for DXP Platform.; Publisher: Altium Limited; Supplier 1: Digi-Key
R38-R40 R43 R56 = RES_10K_0603: RES SMD 10K OHM 1% 1/4W 0603; Manufacturer: Rohm; Manufacturer Part Number: ESR03EZPF1002; Power Rating: 250mW; Temperature Coefficient: 100ppm/°C; Stock 1: 273579; Pricing 1: 1=0.14, 10=0.126, 100=0.0484, 1000=0.0213, 2500=0.01839 (USD); Case/Package: 0603; Case Code (Metric): 1608; Case Code (Imperial): 0603; Min Operating Temperature: -55°C; Max Operating Temperature: 155°C; Tolerance: 1%; Package Quantity: 1; Packaging: Tape and Reel; Composition: Thick Film; Number of Terminations: 2; Max Power Dissipation: 250mW; Features: Automotive AEC-Q200; Length: 0.063inch; Height: 0.022inch; Width: 0.031inch; Lead Free: Lead Free; ComponentLink1URL: https://www.rohm.com/datasheet/ESR01MZPF/esr-e; ComponentLink1Description: https://www.rohm.com/datasheet/ESR01MZPF/esr-e; Supplier 1: Digi-Key
R44 R54 R55 = RES_240_0603: Res Thin Film 0603 240 Ohm 0.1% 0.1W(1/10W) ±25ppm/C Molded SMD Automotive Punched T/R; Manufacturer: Panasonic; Manufacturer Part Number: ERA-3AEB101V; Power Rating: 100mW; Voltage Rating: 75V; Temperature Coefficient: 25ppm/°C; ComponentLink1URL: https://www.rohm.com/datasheet/ESR01MZPF/esr-e; ComponentLink1Description: https://www.rohm.com/datasheet/ESR01MZPF/esr-e; Stock 1: 511300; Pricing 1: 1=0.35, 10=0.3, 100=0.1172, 1000=0.04906, 2500=0.04498 (USD); Mount: Surface Mount; Case/Package: 0603; Number of Pins: 2; Case Code (Metric): 1608; Case Code (Imperial): 0603; Contact Plating: Tin; Min Operating Temperature: -55°C; Max Operating Temperature: 155°C; Tolerance: 0.1%; Packaging: Tape and Reel; Package Quantity: 5000; Composition: Metal Film,Thin Film; Number of Terminations: 2; Termination: SMD/SMT; Military Standard: Not; Max Power Dissipation: 100mW; Length: 1.6mm; Height: 0.45mm; Width: 0.8mm; Depth: 0.8mm; Radiation Hardening: No; REACH SVHC: No SVHC; ComponentLink2URL: http://www.farnell.com/datasheets/485442.pdf; ComponentLink2Description: http://www.farnell.com/datasheets/485442.pdf; ComponentLink3URL: http://industrial.panasonic.com/www-data/pdf/AOA0000/AOA0000CE26.pdf; ComponentLink3Description: http://industrial.panasonic.com/www-data/pdf/AOA0000/AOA0000CE26.pdf; ComponentLink4URL: http://www.farnell.com/datasheets/2059650.pdf; ComponentLink4Description: http://www.farnell.com/datasheets/2059650.pdf; ComponentLink5URL: http://www.farnell.com/datasheets/39837.pdf; ComponentLink5Description: http://www.farnell.com/datasheets/39837.pdf; ComponentLink6URL: http://uk.rs-online.com/webdocs/0fe2/0900766b80fe20f7.pdf; ComponentLink6Description: http://uk.rs-online.com/webdocs/0fe2/0900766b80fe20f7.pdf; ComponentLink7URL: https://www.alliedelec.com/m/d/b6b0537e86f421aa7f5975bb1d8f429a.pdf; ComponentLink7Description: https://www.alliedelec.com/m/d/b6b0537e86f421aa7f5975bb1d8f429a.pdf; ComponentLink8URL: https://www.distrelec.biz/Web/Downloads/_t/ds/ERA_eng_tds.pdf?mime=application%2Fpdf; ComponentLink8Description: https://www.distrelec.biz/Web/Downloads/_t/ds/ERA_eng_tds.pdf?mime=application%2Fpdf; ComponentLink9URL: http://www.produktinfo.conrad.com/datenblaetter/450000-474999/450355-da-01-en-WIDERSTAND_0603_ERA.pdf; ComponentLink9Description: http://www.produktinfo.conrad.com/datenblaetter/450000-474999/450355-da-01-en-WIDERSTAND_0603_ERA.pdf; Supplier 1: Newark
SW1 SW3 SW4 = CMP-1684-00021-1: Tact Switch, SPST-NO, 0.05 A, -35 to 85 degC, 4-Pin THD, RoHS, Bulk; Manufacturer: TE Connectivity; Maximum Contact Resistance: 100mOhm; Mechanical Life: 100000Cycles; Bushing Type: Unthreaded; Switch Configuration: OFF(ON); Maximum DC Voltage Rating: 24V; Contact Rating @ Voltage: 0.05A@24VDC; Actuator Color: Black; Body Orientation: Straight; Function: MomentaryContact; Illumination: N/R; Actuator Style: RoundButton; Actuator Material: PolybutyleneTerephthalate; Dielectric Strength: 500VAC; Pole Throw Configuration: SPST; Actuator Length: 1.4mm; Product Weight: N/A; Contact Material: CopperAlloy; Housing Material: N/A; Terminal Type: PCPins; Minimum Insulation Resistance: 100MOhm; Package Description: 4-Pin Through Hole Device, Body 5.99 x 5.99 mm, Pitch 6.5 mm; Part No: 1825910-6; Package Reference: THD; Base Material: N/A; Manufacturer URL: http://www.te.com; Contact Plating: Silver; RoHS: Yes; Datasheet Version: Rev. C9; Electrical Life: 100000Cycles; Maximum AC Voltage Rating: N/A; Thread Size: N/R; Operating Temperature: -35to85C; Mounting: ThroughHole; Dimension: 5.99x5mm; Datasheet URL: http://www.te.com/commerce/DocumentDelivery/DDEController?Action=showdoc&DocId=Customer+Drawing%7F1825910%7FC9%7Fpdf%7FEnglish%7FENG_CD_1825910_C9.pdf%7F1825910-6; Family: 1825910; Seal Location: N/A; Seal Description: N/A; Packaging: N/A
B5 = 24.243.1: Supplier 1: Newark
HDR1 = 2x8_HDR: Supplier 1: Digi-Key; Supplier Part Number 1: S2011EC-08-ND

## Sheet Ultrascale_EG2.SchDoc
size B; Organization: Altium Limited; Address1: L3, 12a Rodborough Rd; Address2: Frenchs Forest; Address3: NSW; Address4: Australia 2086
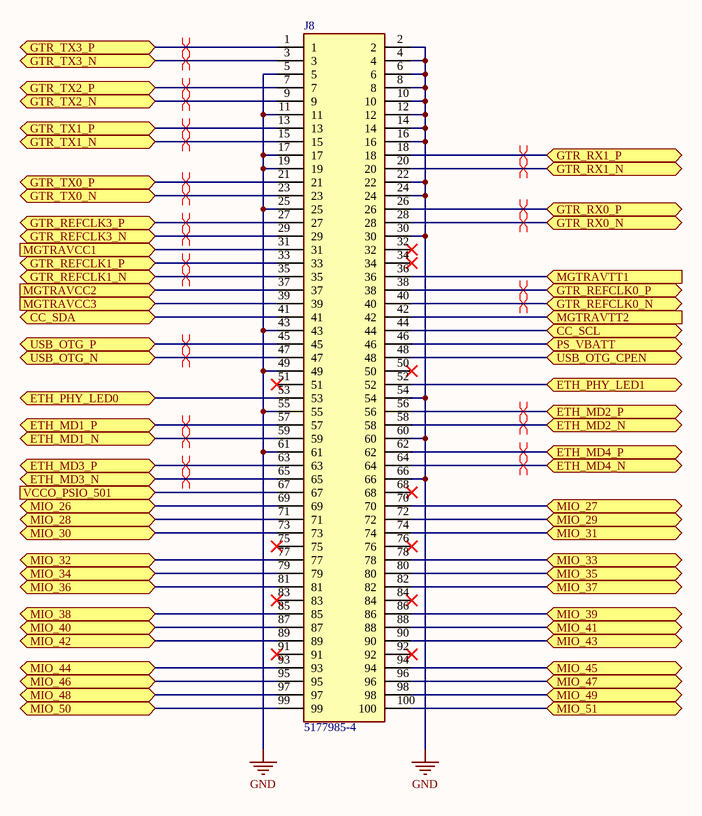
[diagram p4: Ultrascale_EG2.SchDoc]

### Parts
J8  5177985-4  [5177985-4]

### Ports
CC_SCL (bidir), CC_SDA (bidir), ETH_MD1_N (bidir), ETH_MD1_P (bidir), ETH_MD2_N (bidir), ETH_MD2_P (bidir), ETH_MD3_N (bidir), ETH_MD3_P (bidir), ETH_MD4_N (bidir), ETH_MD4_P (bidir), ETH_PHY_LED0 (bidir), ETH_PHY_LED1 (bidir), GTR_REFCLK0_N (bidir), GTR_REFCLK0_P (bidir), GTR_REFCLK1_N (bidir), GTR_REFCLK1_P (bidir), GTR_REFCLK3_N (bidir), GTR_REFCLK3_P (bidir), GTR_RX0_N (bidir), GTR_RX0_P (bidir), GTR_RX1_N (bidir), GTR_RX1_P (bidir), GTR_TX0_N (bidir), GTR_TX0_P (bidir), GTR_TX1_N (bidir), GTR_TX1_P (bidir), GTR_TX2_N (bidir), GTR_TX2_P (bidir), GTR_TX3_N (bidir), GTR_TX3_P (bidir), MGTRAVCC1 (in), MGTRAVCC2 (in), MGTRAVCC3 (in), MGTRAVTT1 (in), MGTRAVTT2 (in), MIO_26 (bidir), MIO_27 (bidir), MIO_28 (bidir), MIO_29 (bidir), MIO_30 (bidir), MIO_31 (bidir), MIO_32 (bidir), MIO_33 (bidir), MIO_34 (bidir), MIO_35 (bidir), MIO_36 (bidir), MIO_37 (bidir), MIO_38 (bidir), MIO_39 (bidir), MIO_40 (bidir), MIO_41 (bidir), MIO_42 (bidir), MIO_43 (bidir), MIO_44 (bidir), MIO_45 (bidir), MIO_46 (bidir), MIO_47 (bidir), MIO_48 (bidir), MIO_49 (bidir), MIO_50 (bidir), MIO_51 (bidir), PS_VBATT (bidir), USB_OTG_CPEN (bidir), USB_OTG_N (bidir), USB_OTG_P (bidir), VCCO_PSIO_501 (in)

### Nets
1V8_PM: J8.36 J8.42 ; port MGTRAVTT1, port MGTRAVTT2
3V3: J8.67 ; port VCCO_PSIO_501
GND: J8.2 J8.4 J8.5 J8.6 J8.8 J8.10 J8.11 J8.12 J8.14 J8.16 J8.17 J8.19 J8.22 J8.24 J8.25 J8.30 J8.43 J8.49 J8.54 J8.55 J8.60 J8.61 J8.66
1V5_VBATT: J8.46 ; port PS_VBATT
cc_fpga_i2c_scl: J8.44 ; port CC_SCL
cc_fpga_i2c_sda: J8.41 ; port CC_SDA
ETH_MD1_N: J8.59 ; port ETH_MD1_N
ETH_MD1_P: J8.57 ; port ETH_MD1_P
ETH_MD2_N: J8.58 ; port ETH_MD2_N
ETH_MD2_P: J8.56 ; port ETH_MD2_P
ETH_MD3_N: J8.65 ; port ETH_MD3_N
ETH_MD3_P: J8.63 ; port ETH_MD3_P
ETH_MD4_N: J8.64 ; port ETH_MD4_N
ETH_MD4_P: J8.62 ; port ETH_MD4_P
GTR_REFCLK0_N: J8.40 ; port GTR_REFCLK0_N
GTR_REFCLK0_P: J8.38 ; port GTR_REFCLK0_P
GTR_REFCLK1_N: J8.35 ; port GTR_REFCLK1_N
GTR_REFCLK1_P: J8.33 ; port GTR_REFCLK1_P
GTR_REFCLK3_N: J8.29 ; port GTR_REFCLK3_N
GTR_REFCLK3_P: J8.27 ; port GTR_REFCLK3_P
GTR_RX0_N: J8.28 ; port GTR_RX0_N
GTR_RX0_P: J8.26 ; port GTR_RX0_P
GTR_RX1_N: J8.20 ; port GTR_RX1_N
GTR_RX1_P: J8.18 ; port GTR_RX1_P
GTR_TX0_N: J8.23 ; port GTR_TX0_N
GTR_TX0_P: J8.21 ; port GTR_TX0_P
GTR_TX1_N: J8.15 ; port GTR_TX1_N
GTR_TX1_P: J8.13 ; port GTR_TX1_P
GTR_TX2_N: J8.9 ; port GTR_TX2_N
GTR_TX2_P: J8.7 ; port GTR_TX2_P
GTR_TX3_N: J8.3 ; port GTR_TX3_N
GTR_TX3_P: J8.1 ; port GTR_TX3_P
GTR_VCC: J8.31 J8.37 J8.39 ; port MGTRAVCC1, port MGTRAVCC2, port MGTRAVCC3
USB3_D_N: J8.47 ; port USB_OTG_N
USB3_D_P: J8.45 ; port USB_OTG_P
NetJ1_1: J8.97 ; port MIO_48
NetJ1_2: J8.98 ; port MIO_49
NetJ1_3: J8.99 ; port MIO_50
NetJ1_7: J8.95 ; port MIO_46
NetJ1_8: J8.96 ; port MIO_47
NetJ1_10: J8.94 ; port MIO_45
NetJ8_48: J8.48 ; port USB_OTG_CPEN
NetJ8_52: J8.52 ; port ETH_PHY_LED1
NetJ8_53: J8.53 ; port ETH_PHY_LED0
NetJ8_69: J8.69 ; port MIO_26
NetJ8_70: J8.70 ; port MIO_27
NetJ8_71: J8.71 ; port MIO_28
NetJ8_72: J8.72 ; port MIO_29
NetJ8_73: J8.73 ; port MIO_30
NetJ8_74: J8.74 ; port MIO_31
NetJ8_77: J8.77 ; port MIO_32
NetJ8_78: J8.78 ; port MIO_33
NetJ8_79: J8.79 ; port MIO_34
NetJ8_80: J8.80 ; port MIO_35
NetJ8_81: J8.81 ; port MIO_36
NetJ8_82: J8.82 ; port MIO_37
NetJ8_85: J8.85 ; port MIO_38
NetJ8_86: J8.86 ; port MIO_39
NetJ8_87: J8.87 ; port MIO_40
NetJ8_88: J8.88 ; port MIO_41
NetJ8_89: J8.89 ; port MIO_42
NetJ8_90: J8.90 ; port MIO_43
NetJ8_93: J8.93 ; port MIO_44
NetJ8_100: J8.100 ; port MIO_51

Not connected (* = marked no-connect by the designer): J8 32* 34* 50* 51* 68* 75* 76* 83* 84* 91* 92*

### Layout directives
differential pair: ETH_MD1_N, ETH_MD1_P, ETH_MD2_N, ETH_MD2_P, ETH_MD3_N, ETH_MD3_P, ETH_MD4_N, ETH_MD4_P, GTR_REFCLK0_N, GTR_REFCLK0_P, GTR_REFCLK1_N, GTR_REFCLK1_P, GTR_REFCLK3_N, GTR_REFCLK3_P, GTR_RX0_N, GTR_RX0_P, GTR_RX1_N, GTR_RX1_P, GTR_TX0_N, GTR_TX0_P, GTR_TX1_N, GTR_TX1_P, GTR_TX2_N, GTR_TX2_P, GTR_TX3_N, GTR_TX3_P, USB3_D_N, USB3_D_P

### Notes on the sheet
- Title
- Size:
- Date:
- B
- Number:
- Time:
- Revision:
- Sheet
- of
- File:

### Library data of the parts
J8 = 5177985-4: Connector; Manufacturer_Name: TE Connectivity; Allied_Number: R1112643; Datasheet Link: https://www.te.com/commerce/DocumentDelivery/DDEController?Action=srchrtrv&DocNm=5177985&DocType=Customer+Drawing&DocLang=English&DocFormat=pdf&PartCntxt=5177985-4; Manufacturer_Part_Number: 5177985-4; Mouser Part Number: 571-5177985-4; Mouser Price/Stock: https://www.mouser.com/Search/Refine.aspx?Keyword=571-5177985-4; RS Part Number: 1647793; RS Price/Stock: http://uk.rs-online.com/web/p/products/1647793; Allied Price/Stock: http://www.alliedelec.com/te-connectivity-5177985-4/R1112643/

## Sheet Ultrascale_EG.SchDoc
size B; Organization: Altium Limited; Address1: L3, 12a Rodborough Rd; Address2: Frenchs Forest; Address3: NSW; Address4: Australia 2086
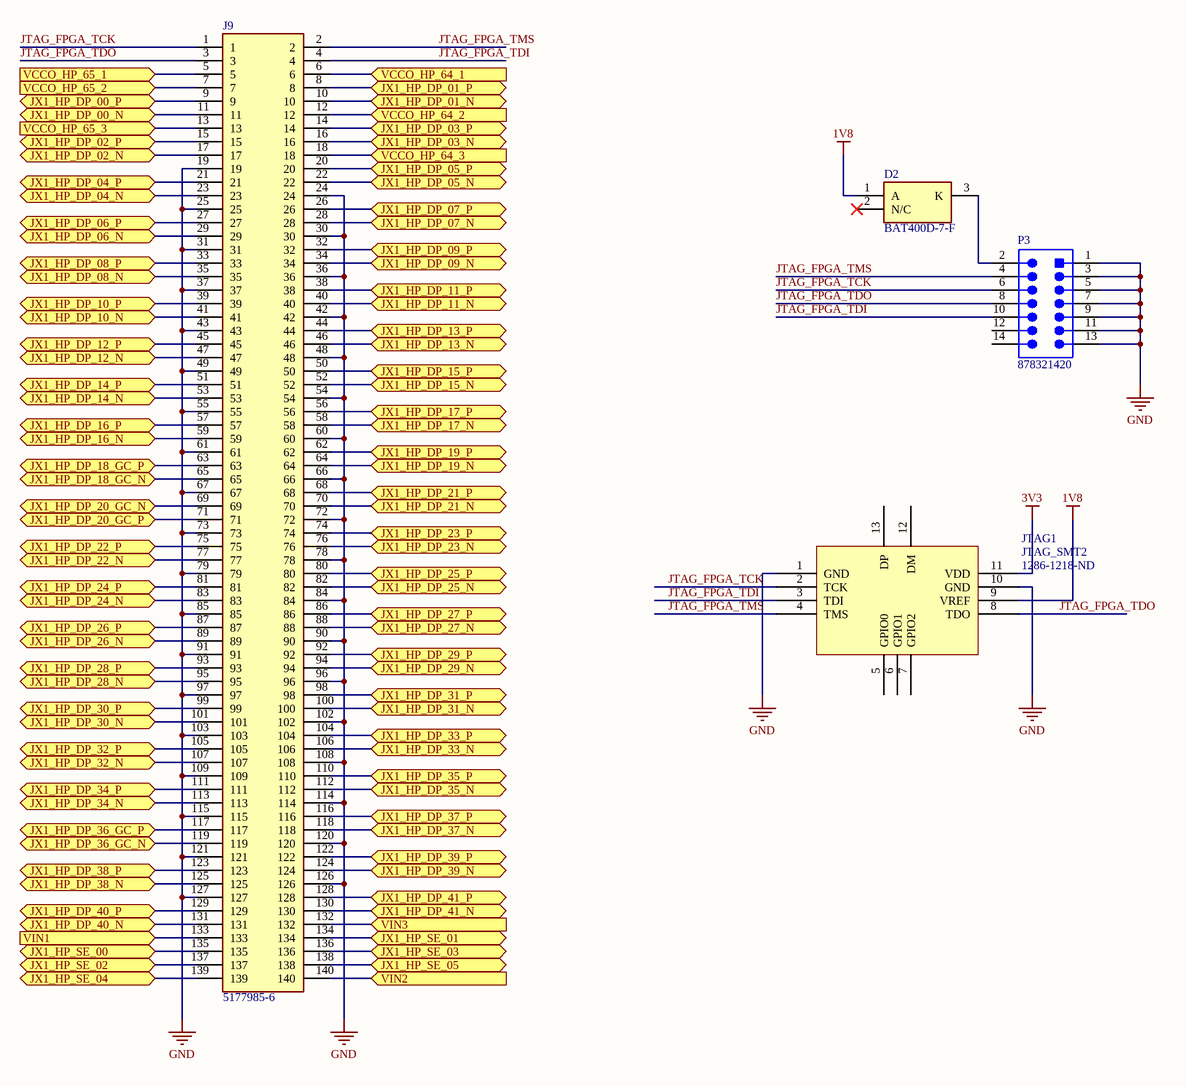
[diagram p5: Ultrascale_EG.SchDoc]

### Parts
D2  BAT400D-7-F  [SOT96P240X110-3N]
J9  5177985-6  [5177985-6]
JTAG1  JTAG_SMT2  Supplier Part Number 1: 1286-1218-ND  [JTAG_SMT2]
P3  878321420  [MOLX-878321420_V]

### Ports
JX1_HP_DP_00_N (bidir), JX1_HP_DP_00_P (bidir), JX1_HP_DP_01_N (bidir), JX1_HP_DP_01_P (bidir), JX1_HP_DP_02_N (bidir), JX1_HP_DP_02_P (bidir), JX1_HP_DP_03_N (bidir), JX1_HP_DP_03_P (bidir), JX1_HP_DP_04_N (bidir), JX1_HP_DP_04_P (bidir), JX1_HP_DP_05_N (bidir), JX1_HP_DP_05_P (bidir), JX1_HP_DP_06_N (bidir), JX1_HP_DP_06_P (bidir), JX1_HP_DP_07_N (bidir), JX1_HP_DP_07_P (bidir), JX1_HP_DP_08_N (bidir), JX1_HP_DP_08_P (bidir), JX1_HP_DP_09_N (bidir), JX1_HP_DP_09_P (bidir), JX1_HP_DP_10_N (bidir), JX1_HP_DP_10_P (bidir), JX1_HP_DP_11_N (bidir), JX1_HP_DP_11_P (bidir), JX1_HP_DP_12_N (bidir), JX1_HP_DP_12_P (bidir), JX1_HP_DP_13_N (bidir), JX1_HP_DP_13_P (bidir), JX1_HP_DP_14_N (bidir), JX1_HP_DP_14_P (bidir), JX1_HP_DP_15_N (bidir), JX1_HP_DP_15_P (bidir), JX1_HP_DP_16_N (bidir), JX1_HP_DP_16_P (bidir), JX1_HP_DP_17_N (bidir), JX1_HP_DP_17_P (bidir), JX1_HP_DP_18_GC_N (bidir), JX1_HP_DP_18_GC_P (bidir), JX1_HP_DP_19_N (bidir), JX1_HP_DP_19_P (bidir), JX1_HP_DP_20_GC_N (bidir), JX1_HP_DP_20_GC_P (bidir), JX1_HP_DP_21_N (bidir), JX1_HP_DP_21_P (bidir), JX1_HP_DP_22_N (bidir), JX1_HP_DP_22_P (bidir), JX1_HP_DP_23_N (bidir), JX1_HP_DP_23_P (bidir), JX1_HP_DP_24_N (bidir), JX1_HP_DP_24_P (bidir), JX1_HP_DP_25_N (bidir), JX1_HP_DP_25_P (bidir), JX1_HP_DP_26_N (bidir), JX1_HP_DP_26_P (bidir), JX1_HP_DP_27_N (bidir), JX1_HP_DP_27_P (bidir), JX1_HP_DP_28_N (bidir), JX1_HP_DP_28_P (bidir), JX1_HP_DP_29_N (bidir), JX1_HP_DP_29_P (bidir), JX1_HP_DP_30_N (bidir), JX1_HP_DP_30_P (bidir), JX1_HP_DP_31_N (bidir), JX1_HP_DP_31_P (bidir), JX1_HP_DP_32_N (bidir), JX1_HP_DP_32_P (bidir), JX1_HP_DP_33_N (bidir), JX1_HP_DP_33_P (bidir), JX1_HP_DP_34_N (bidir), JX1_HP_DP_34_P (bidir), JX1_HP_DP_35_N (bidir), JX1_HP_DP_35_P (bidir), JX1_HP_DP_36_GC_N (bidir), JX1_HP_DP_36_GC_P (bidir), JX1_HP_DP_37_N (bidir), JX1_HP_DP_37_P (bidir), JX1_HP_DP_38_N (bidir), JX1_HP_DP_38_P (bidir), JX1_HP_DP_39_N (bidir), JX1_HP_DP_39_P (bidir), JX1_HP_DP_40_N (bidir), JX1_HP_DP_40_P (bidir), JX1_HP_DP_41_N (bidir), JX1_HP_DP_41_P (bidir), JX1_HP_SE_00 (bidir), JX1_HP_SE_01 (bidir), JX1_HP_SE_02 (bidir), JX1_HP_SE_03 (bidir), JX1_HP_SE_04 (bidir), JX1_HP_SE_05 (bidir), VCCO_HP_64_1 (in), VCCO_HP_64_2 (in), VCCO_HP_64_3 (in), VCCO_HP_65_1 (in), VCCO_HP_65_2 (in), VCCO_HP_65_3 (in), VIN1 (in), VIN2 (in), VIN3 (in)

### Nets
1V8: D2.1(A) JTAG1.9(VREF)  [project net 1V8_OUT]
1V8_PM: J9.5 J9.6 J9.7 J9.12 J9.13 J9.18 ; port VCCO_HP_65_1, port VCCO_HP_64_1, port VCCO_HP_65_2, port VCCO_HP_65_3, port VCCO_HP_64_2, port VCCO_HP_64_3
3V3: JTAG1.11(VDD)
12V: J9.132 J9.133 J9.140 ; port VIN2, port VIN1, port VIN3
GND: J9.19 J9.24 J9.25 J9.30 J9.31 J9.36 J9.37 J9.42 J9.43 J9.48 J9.49 J9.54 J9.55 J9.60 J9.61 J9.66 J9.67 J9.72 J9.73 J9.78 J9.79 J9.84 J9.85 J9.90 J9.91 J9.96 J9.97 J9.102 J9.103 J9.108 J9.109 J9.114 J9.115 J9.120 J9.121 J9.126 J9.127 JTAG1.1(GND) JTAG1.10(GND) P3.1 P3.3 P3.5 P3.7 P3.9 P3.11 P3.13
CAM0_C_N: J9.65 ; port JX1_HP_DP_18_GC_N
CAM0_C_P: J9.63 ; port JX1_HP_DP_18_GC_P
CAM0_D0_N: J9.11 ; port JX1_HP_DP_00_N
CAM0_D0_P: J9.9 ; port JX1_HP_DP_00_P
CAM0_D1_N: J9.17 ; port JX1_HP_DP_02_N
CAM0_D1_P: J9.15 ; port JX1_HP_DP_02_P
CAM1_C_N: J9.69 ; port JX1_HP_DP_20_GC_N
CAM1_C_P: J9.71 ; port JX1_HP_DP_20_GC_P
CAM1_D0_N: J9.29 ; port JX1_HP_DP_06_N
CAM1_D0_P: J9.27 ; port JX1_HP_DP_06_P
CAM1_D1_N: J9.23 ; port JX1_HP_DP_04_N
CAM1_D1_P: J9.21 ; port JX1_HP_DP_04_P
dp_jtag_tck: J9.131 ; port JX1_HP_DP_40_N
dp_jtag_tdi: J9.125 ; port JX1_HP_DP_38_N
dp_jtag_tdo: J9.122 ; port JX1_HP_DP_39_P
dp_jtag_tms: J9.129 ; port JX1_HP_DP_40_P
dp_jtag_trstn: J9.124 ; port JX1_HP_DP_39_N
JTAG_FPGA_TCK: J9.1 JTAG1.2(TCK) P3.6
JTAG_FPGA_TDI: J9.4 JTAG1.3(TDI) P3.10
JTAG_FPGA_TDO: J9.3 JTAG1.8(TDO) P3.8
JTAG_FPGA_TMS: J9.2 JTAG1.4(TMS) P3.4
LED1: J9.123 ; port JX1_HP_DP_38_P
LED2: J9.118 ; port JX1_HP_DP_37_N
LED3: J9.116 ; port JX1_HP_DP_37_P
tlx_rev_payload_tdata0: J9.93 ; port JX1_HP_DP_28_P
tlx_rev_payload_tdata1: J9.88 ; port JX1_HP_DP_27_N
tlx_rev_payload_tdata2: J9.86 ; port JX1_HP_DP_27_P
tlx_rev_payload_tdata3: J9.89 ; port JX1_HP_DP_26_N
tlx_rev_payload_tdata4: J9.87 ; port JX1_HP_DP_26_P
tlx_rev_payload_tdata5: J9.82 ; port JX1_HP_DP_25_N
tlx_rev_payload_tdata6: J9.80 ; port JX1_HP_DP_25_P
tlx_rev_payload_tdata7: J9.83 ; port JX1_HP_DP_24_N
tlx_rev_payload_tdata8: J9.81 ; port JX1_HP_DP_24_P
tlx_rev_payload_tdata9: J9.76 ; port JX1_HP_DP_23_N
tlx_rev_payload_tdata10: J9.74 ; port JX1_HP_DP_23_P
tlx_rev_payload_tdata11: J9.77 ; port JX1_HP_DP_22_N
tlx_rev_payload_tdata12: J9.75 ; port JX1_HP_DP_22_P
tlx_rev_payload_tdata13: J9.70 ; port JX1_HP_DP_21_N
tlx_rev_payload_tdata14: J9.68 ; port JX1_HP_DP_21_P
tlx_rev_payload_tdata15: J9.64 ; port JX1_HP_DP_19_N
tlx_rev_payload_tdata16: J9.62 ; port JX1_HP_DP_19_P
tlx_rev_payload_tdata17: J9.58 ; port JX1_HP_DP_17_N
tlx_rev_payload_tdata18: J9.56 ; port JX1_HP_DP_17_P
tlx_rev_payload_tdata19: J9.59 ; port JX1_HP_DP_16_N
tlx_rev_payload_tdata20: J9.57 ; port JX1_HP_DP_16_P
tlx_rev_payload_tdata21: J9.52 ; port JX1_HP_DP_15_N
tlx_rev_payload_tdata22: J9.50 ; port JX1_HP_DP_15_P
tlx_rev_payload_tdata23: J9.53 ; port JX1_HP_DP_14_N
tlx_rev_payload_tdata24: J9.51 ; port JX1_HP_DP_14_P
tlx_rev_payload_tdata25: J9.46 ; port JX1_HP_DP_13_N
tlx_rev_payload_tdata26: J9.44 ; port JX1_HP_DP_13_P
tlx_rev_payload_tdata27: J9.47 ; port JX1_HP_DP_12_N
tlx_rev_payload_tdata28: J9.45 ; port JX1_HP_DP_12_P
tlx_rev_payload_tdata29: J9.40 ; port JX1_HP_DP_11_N
tlx_rev_payload_tdata30: J9.38 ; port JX1_HP_DP_11_P
tlx_rev_payload_tdata31: J9.41 ; port JX1_HP_DP_10_N
tlx_rev_payload_tdata32: J9.39 ; port JX1_HP_DP_10_P
tlx_rev_payload_tdata33: J9.34 ; port JX1_HP_DP_09_N
tlx_rev_payload_tdata34: J9.32 ; port JX1_HP_DP_09_P
tlx_rev_payload_tdata35: J9.35 ; port JX1_HP_DP_08_N
tlx_rev_payload_tdata36: J9.33 ; port JX1_HP_DP_08_P
tlx_rev_payload_tdata37: J9.28 ; port JX1_HP_DP_07_N
tlx_rev_payload_tdata38: J9.26 ; port JX1_HP_DP_07_P
tlx_rev_payload_tdata39: J9.22 ; port JX1_HP_DP_05_N
tlx_rev_payload_tdata40: J9.20 ; port JX1_HP_DP_05_P
tlx_rev_payload_tdata41: J9.16 ; port JX1_HP_DP_03_N
tlx_rev_payload_tdata42: J9.14 ; port JX1_HP_DP_03_P
tlx_rev_payload_tdata43: J9.10 ; port JX1_HP_DP_01_N
tlx_rev_payload_tdata44: J9.8 ; port JX1_HP_DP_01_P
tlx_rev_payload_tdata45: J9.95 ; port JX1_HP_DP_28_N
tlx_rev_payload_tdata46: J9.92 ; port JX1_HP_DP_29_P
tlx_rev_payload_tdata47: J9.94 ; port JX1_HP_DP_29_N
tlx_rev_payload_tdata48: J9.99 ; port JX1_HP_DP_30_P
tlx_rev_payload_tdata49: J9.101 ; port JX1_HP_DP_30_N
tlx_rev_payload_tdata50: J9.98 ; port JX1_HP_DP_31_P
tlx_rev_payload_tdata51: J9.100 ; port JX1_HP_DP_31_N
tlx_rev_payload_tdata52: J9.105 ; port JX1_HP_DP_32_P
tlx_rev_payload_tdata53: J9.107 ; port JX1_HP_DP_32_N
tlx_rev_payload_tdata54: J9.104 ; port JX1_HP_DP_33_P
tlx_rev_payload_tdata55: J9.106 ; port JX1_HP_DP_33_N
tlx_rev_payload_tdata56: J9.111 ; port JX1_HP_DP_34_P
tlx_rev_payload_tdata57: J9.113 ; port JX1_HP_DP_34_N
tlx_rev_payload_tdata58: J9.110 ; port JX1_HP_DP_35_P
tlx_rev_payload_tdata59: J9.112 ; port JX1_HP_DP_35_N
tlx_rev_payload_tdata60: J9.117 ; port JX1_HP_DP_36_GC_P
tlx_rev_payload_tdata61: J9.119 ; port JX1_HP_DP_36_GC_N
tlx_rev_payload_tdata72: J9.135 ; port JX1_HP_SE_00
tlx_rev_payload_tdata73: J9.134 ; port JX1_HP_SE_01
tlx_rev_payload_tdata74: J9.137 ; port JX1_HP_SE_02
tlx_rev_payload_tdata75: J9.136 ; port JX1_HP_SE_03
tlx_rev_payload_tdata76: J9.139 ; port JX1_HP_SE_04
tlx_rev_payload_tdata77: J9.138 ; port JX1_HP_SE_05
NetD2_3: D2.3(K) P3.2
NetJ9_128: J9.128 ; port JX1_HP_DP_41_P
NetJ9_130: J9.130 ; port JX1_HP_DP_41_N

Not connected (* = marked no-connect by the designer): D2 2(N/C)*; JTAG1 5(GPIO0) 6(GPIO1) 7(GPIO2) 12(DM) 13(DP); P3 12 14

### Notes on the sheet
- Title
- Size:
- Date:
- B
- Number:
- Time:
- Revision:
- Sheet
- of
- File:

### Library data of the parts
D2 = BAT400D-7-F: Schottky Diode; Manufacturer_Name: Diodes Inc.; Datasheet Link: https://www.diodes.com/assets/Datasheets/ds30182.pdf; Height: 1.1mm; Manufacturer_Part_Number: BAT400D-7-F; Mouser Part Number: 621-BAT400D-F; Mouser Price/Stock: https://www.mouser.com/Search/Refine.aspx?Keyword=621-BAT400D-F; RS Part Number: 7513354P; RS Price/Stock: http://uk.rs-online.com/web/p/products/7513354P
J9 = 5177985-6: Connector; Manufacturer_Name: TE Connectivity; Datasheet Link: https://www.te.com/commerce/DocumentDelivery/DDEController?Action=srchrtrv&DocNm=5177985&DocType=Customer+Drawing&DocLang=English&DocFormat=pdf&PartCntxt=5177985-6; Manufacturer_Part_Number: 5177985-6; Mouser Part Number: 571-5177985-6; Mouser Price/Stock: https://www.mouser.com/Search/Refine.aspx?Keyword=571-5177985-6
P3 = CMP-2000-05520-1: Male Header, Pitch 2 mm, 2 x 7 Position, Height 7.6 mm, -55 to 105 degC, RoHS; Manufacturer: Molex; Datasheet URL: http://www.molex.com/pdm_docs/sd/878321420_sd.pdf; Package Description: Male Header, Pitch 2 mm, 2 x 7 Positions, Height 7.6 mm; Manufacturer URL: http://www.molex.com/; Package Reference: 878321420; Datasheet Version: Rev. G, 01/2012; Mounting Technology: SurfaceMount
JTAG1 = JTAG_SMT2: Supplier 1: Digi-Key

## Sheet Ultrascale_EG3.SchDoc
size B; Organization: Altium Limited; Address1: L3, 12a Rodborough Rd; Address2: Frenchs Forest; Address3: NSW; Address4: Australia 2086
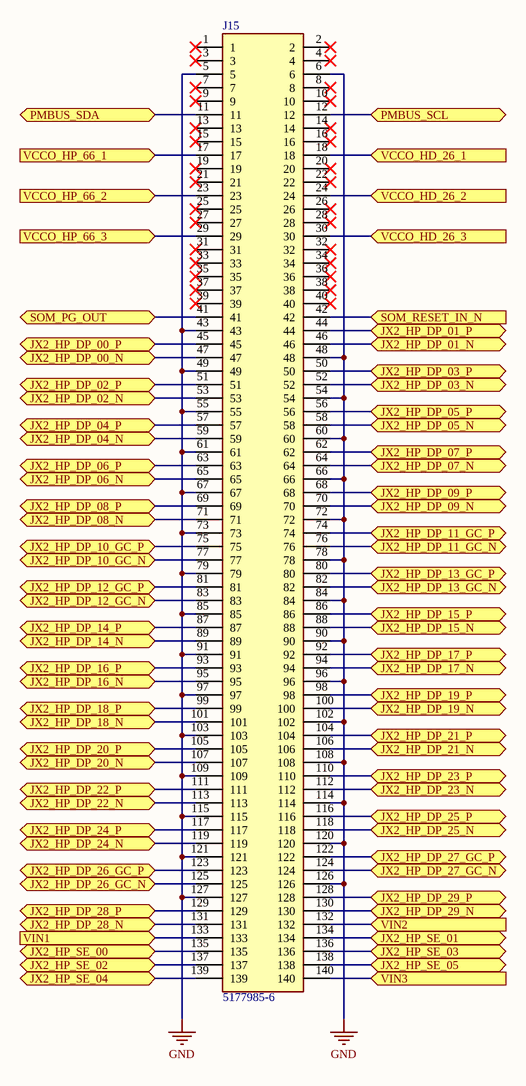
[diagram p6: Ultrascale_EG3.SchDoc]

### Parts
J15  5177985-6  [5177985-6]

### Ports
JX2_HP_DP_00_N (bidir), JX2_HP_DP_00_P (bidir), JX2_HP_DP_01_N (bidir), JX2_HP_DP_01_P (bidir), JX2_HP_DP_02_N (bidir), JX2_HP_DP_02_P (bidir), JX2_HP_DP_03_N (bidir), JX2_HP_DP_03_P (bidir), JX2_HP_DP_04_N (bidir), JX2_HP_DP_04_P (bidir), JX2_HP_DP_05_N (bidir), JX2_HP_DP_05_P (bidir), JX2_HP_DP_06_N (bidir), JX2_HP_DP_06_P (bidir), JX2_HP_DP_07_N (bidir), JX2_HP_DP_07_P (bidir), JX2_HP_DP_08_N (bidir), JX2_HP_DP_08_P (bidir), JX2_HP_DP_09_N (bidir), JX2_HP_DP_09_P (bidir), JX2_HP_DP_10_GC_N (bidir), JX2_HP_DP_10_GC_P (bidir), JX2_HP_DP_11_GC_N (bidir), JX2_HP_DP_11_GC_P (bidir), JX2_HP_DP_12_GC_N (bidir), JX2_HP_DP_12_GC_P (bidir), JX2_HP_DP_13_GC_N (bidir), JX2_HP_DP_13_GC_P (bidir), JX2_HP_DP_14_N (bidir), JX2_HP_DP_14_P (bidir), JX2_HP_DP_15_N (bidir), JX2_HP_DP_15_P (bidir), JX2_HP_DP_16_N (bidir), JX2_HP_DP_16_P (bidir), JX2_HP_DP_17_N (bidir), JX2_HP_DP_17_P (bidir), JX2_HP_DP_18_N (bidir), JX2_HP_DP_18_P (bidir), JX2_HP_DP_19_N (bidir), JX2_HP_DP_19_P (bidir), JX2_HP_DP_20_N (bidir), JX2_HP_DP_20_P (bidir), JX2_HP_DP_21_N (bidir), JX2_HP_DP_21_P (bidir), JX2_HP_DP_22_N (bidir), JX2_HP_DP_22_P (bidir), JX2_HP_DP_23_N (bidir), JX2_HP_DP_23_P (bidir), JX2_HP_DP_24_N (bidir), JX2_HP_DP_24_P (bidir), JX2_HP_DP_25_N (bidir), JX2_HP_DP_25_P (bidir), JX2_HP_DP_26_GC_N (bidir), JX2_HP_DP_26_GC_P (bidir), JX2_HP_DP_27_GC_N (bidir), JX2_HP_DP_27_GC_P (bidir), JX2_HP_DP_28_N (bidir), JX2_HP_DP_28_P (bidir), JX2_HP_DP_29_N (bidir), JX2_HP_DP_29_P (bidir), JX2_HP_SE_00 (bidir), JX2_HP_SE_01 (bidir), JX2_HP_SE_02 (bidir), JX2_HP_SE_03 (bidir), JX2_HP_SE_04 (bidir), JX2_HP_SE_05 (bidir), PMBUS_SCL (bidir), PMBUS_SDA (bidir), SOM_PG_OUT (bidir), SOM_RESET_IN_N (in), VCCO_HD_26_1 (in), VCCO_HD_26_2 (in), VCCO_HD_26_3 (in), VCCO_HP_66_1 (in), VCCO_HP_66_2 (in), VCCO_HP_66_3 (in), VIN1 (in), VIN2 (in), VIN3 (in)

### Nets
1V8_PM: J15.17 J15.18 J15.23 J15.24 J15.29 J15.30 ; port VCCO_HP_66_1, port VCCO_HP_66_2, port VCCO_HP_66_3, port VCCO_HD_26_1, port VCCO_HD_26_2, port VCCO_HD_26_3
12V: J15.132 J15.133 J15.140 ; port VIN1, port VIN2, port VIN3
GND: J15.5 J15.6 J15.43 J15.48 J15.49 J15.54 J15.55 J15.60 J15.61 J15.66 J15.67 J15.72 J15.73 J15.78 J15.79 J15.84 J15.85 J15.90 J15.91 J15.96 J15.97 J15.102 J15.103 J15.108 J15.109 J15.114 J15.115 J15.120 J15.121 J15.126 J15.127
cgra_clk: J15.128 ; port JX2_HP_DP_29_P
FPGA_CGRA_RESET_N: J15.136 ; port JX2_HP_SE_03
fpga_i2c_scl: J15.131 ; port JX2_HP_DP_28_N
fpga_i2c_sda: J15.129 ; port JX2_HP_DP_28_P
fpga_PMBUS_SCL: J15.12 ; port PMBUS_SCL
fpga_PMBUS_SDA: J15.11 ; port PMBUS_SDA
pico_ready: J15.130 ; port JX2_HP_DP_29_N
SOM_PG_OUT: J15.41 ; port SOM_PG_OUT
SOM_RESET_IN_N: J15.42 ; port SOM_RESET_IN_N
tlx_fwd_clk: J15.75 ; port JX2_HP_DP_10_GC_P
tlx_fwd_flow_tdata0: J15.68 ; port JX2_HP_DP_09_P
tlx_fwd_flow_tdata1: J15.69 ; port JX2_HP_DP_08_P
tlx_fwd_flow_tready: J15.71 ; port JX2_HP_DP_08_N
tlx_fwd_flow_tvalid: J15.70 ; port JX2_HP_DP_09_N
tlx_fwd_payload_tdata0: J15.64 ; port JX2_HP_DP_07_N
tlx_fwd_payload_tdata1: J15.65 ; port JX2_HP_DP_06_N
tlx_fwd_payload_tdata2: J15.62 ; port JX2_HP_DP_07_P
tlx_fwd_payload_tdata3: J15.63 ; port JX2_HP_DP_06_P
tlx_fwd_payload_tdata4: J15.59 ; port JX2_HP_DP_04_N
tlx_fwd_payload_tdata5: J15.58 ; port JX2_HP_DP_05_N
tlx_fwd_payload_tdata6: J15.57 ; port JX2_HP_DP_04_P
tlx_fwd_payload_tdata7: J15.56 ; port JX2_HP_DP_05_P
tlx_fwd_payload_tdata8: J15.53 ; port JX2_HP_DP_02_N
tlx_fwd_payload_tdata9: J15.51 ; port JX2_HP_DP_02_P
tlx_fwd_payload_tdata10: J15.52 ; port JX2_HP_DP_03_N
tlx_fwd_payload_tdata11: J15.50 ; port JX2_HP_DP_03_P
tlx_fwd_payload_tdata12: J15.47 ; port JX2_HP_DP_00_N
tlx_fwd_payload_tdata13: J15.45 ; port JX2_HP_DP_00_P
tlx_fwd_payload_tdata14: J15.46 ; port JX2_HP_DP_01_N
tlx_fwd_payload_tdata15: J15.44 ; port JX2_HP_DP_01_P
tlx_fwd_payload_tdata16: J15.105 ; port JX2_HP_DP_20_P
tlx_fwd_payload_tdata17: J15.118 ; port JX2_HP_DP_25_N
tlx_fwd_payload_tdata18: J15.116 ; port JX2_HP_DP_25_P
tlx_fwd_payload_tdata19: J15.101 ; port JX2_HP_DP_18_N
tlx_fwd_payload_tdata20: J15.99 ; port JX2_HP_DP_18_P
tlx_fwd_payload_tdata21: J15.104 ; port JX2_HP_DP_21_P
tlx_fwd_payload_tdata22: J15.95 ; port JX2_HP_DP_16_N
tlx_fwd_payload_tdata23: J15.100 ; port JX2_HP_DP_19_N
tlx_fwd_payload_tdata24: J15.93 ; port JX2_HP_DP_16_P
tlx_fwd_payload_tdata25: J15.98 ; port JX2_HP_DP_19_P
tlx_fwd_payload_tdata26: J15.94 ; port JX2_HP_DP_17_N
tlx_fwd_payload_tdata27: J15.89 ; port JX2_HP_DP_14_N
tlx_fwd_payload_tdata28: J15.92 ; port JX2_HP_DP_17_P
tlx_fwd_payload_tdata29: J15.87 ; port JX2_HP_DP_14_P
tlx_fwd_payload_tdata30: J15.88 ; port JX2_HP_DP_15_N
tlx_fwd_payload_tdata31: J15.86 ; port JX2_HP_DP_15_P
tlx_fwd_payload_tdata32: J15.83 ; port JX2_HP_DP_12_GC_N
tlx_fwd_payload_tdata33: J15.81 ; port JX2_HP_DP_12_GC_P
tlx_fwd_payload_tdata34: J15.82 ; port JX2_HP_DP_13_GC_N
tlx_fwd_payload_tdata35: J15.80 ; port JX2_HP_DP_13_GC_P
tlx_fwd_payload_tdata36: J15.77 ; port JX2_HP_DP_10_GC_N
tlx_fwd_payload_tdata37: J15.76 ; port JX2_HP_DP_11_GC_N
tlx_fwd_payload_tdata38: J15.119 ; port JX2_HP_DP_24_N
tlx_fwd_payload_tdata39: J15.74 ; port JX2_HP_DP_11_GC_P
tlx_fwd_payload_tready: J15.107 ; port JX2_HP_DP_20_N
tlx_fwd_payload_tvalid: J15.117 ; port JX2_HP_DP_24_P
tlx_rev_clk: J15.122 ; port JX2_HP_DP_27_GC_P
tlx_rev_flow_tdata0: J15.111 ; port JX2_HP_DP_22_P
tlx_rev_flow_tdata1: J15.112 ; port JX2_HP_DP_23_N
tlx_rev_flow_tdata2: J15.113 ; port JX2_HP_DP_22_N
tlx_rev_flow_tready: J15.110 ; port JX2_HP_DP_23_P
tlx_rev_flow_tvalid: J15.106 ; port JX2_HP_DP_21_N
tlx_rev_payload_tdata78: J15.138 ; port JX2_HP_SE_05
tlx_rev_payload_tdata79: J15.139 ; port JX2_HP_SE_04
tlx_rev_payload_tready: J15.124 ; port JX2_HP_DP_27_GC_N
tlx_rev_payload_tvalid: J15.123 ; port JX2_HP_DP_26_GC_P
uart0_rxd: J15.137 ; port JX2_HP_SE_02
uart0_txd: J15.135 ; port JX2_HP_SE_00
uart1_rxd: J15.125 ; port JX2_HP_DP_26_GC_N
uart1_txd: J15.134 ; port JX2_HP_SE_01

Not connected (* = marked no-connect by the designer): J15 1* 2* 3* 4* 7* 8* 9* 10* 13* 14* 15* 16* 19* 20* 21* 22* 25* 26* 27* 28* 31* 32* 33* 34* 35* 36* 37* 38* 39* 40*

### Notes on the sheet
- Title
- Size:
- Date:
- B
- Number:
- Time:
- Revision:
- Sheet
- of
- File:

### Library data of the parts
J15 = 5177985-6: as J9 on sheet Ultrascale_EG; Datasheet Link: https://www.te.com/commerce/DocumentDelivery/DDEController?Action=srchrtrv&DocNm=5177985&DocType=Customer+Drawing&DocLang=English&DocFormat=pdf&PartCntxt=5177985-6; Manufacturer_Part_Number: 5177985-6; Mouser Part Number: 571-5177985-6; Mouser Price/Stock: https://www.mouser.com/Search/Refine.aspx?Keyword=571-5177985-6